# EAGLE design board (EAGLE 6.4)

## Sheet 1 of 5
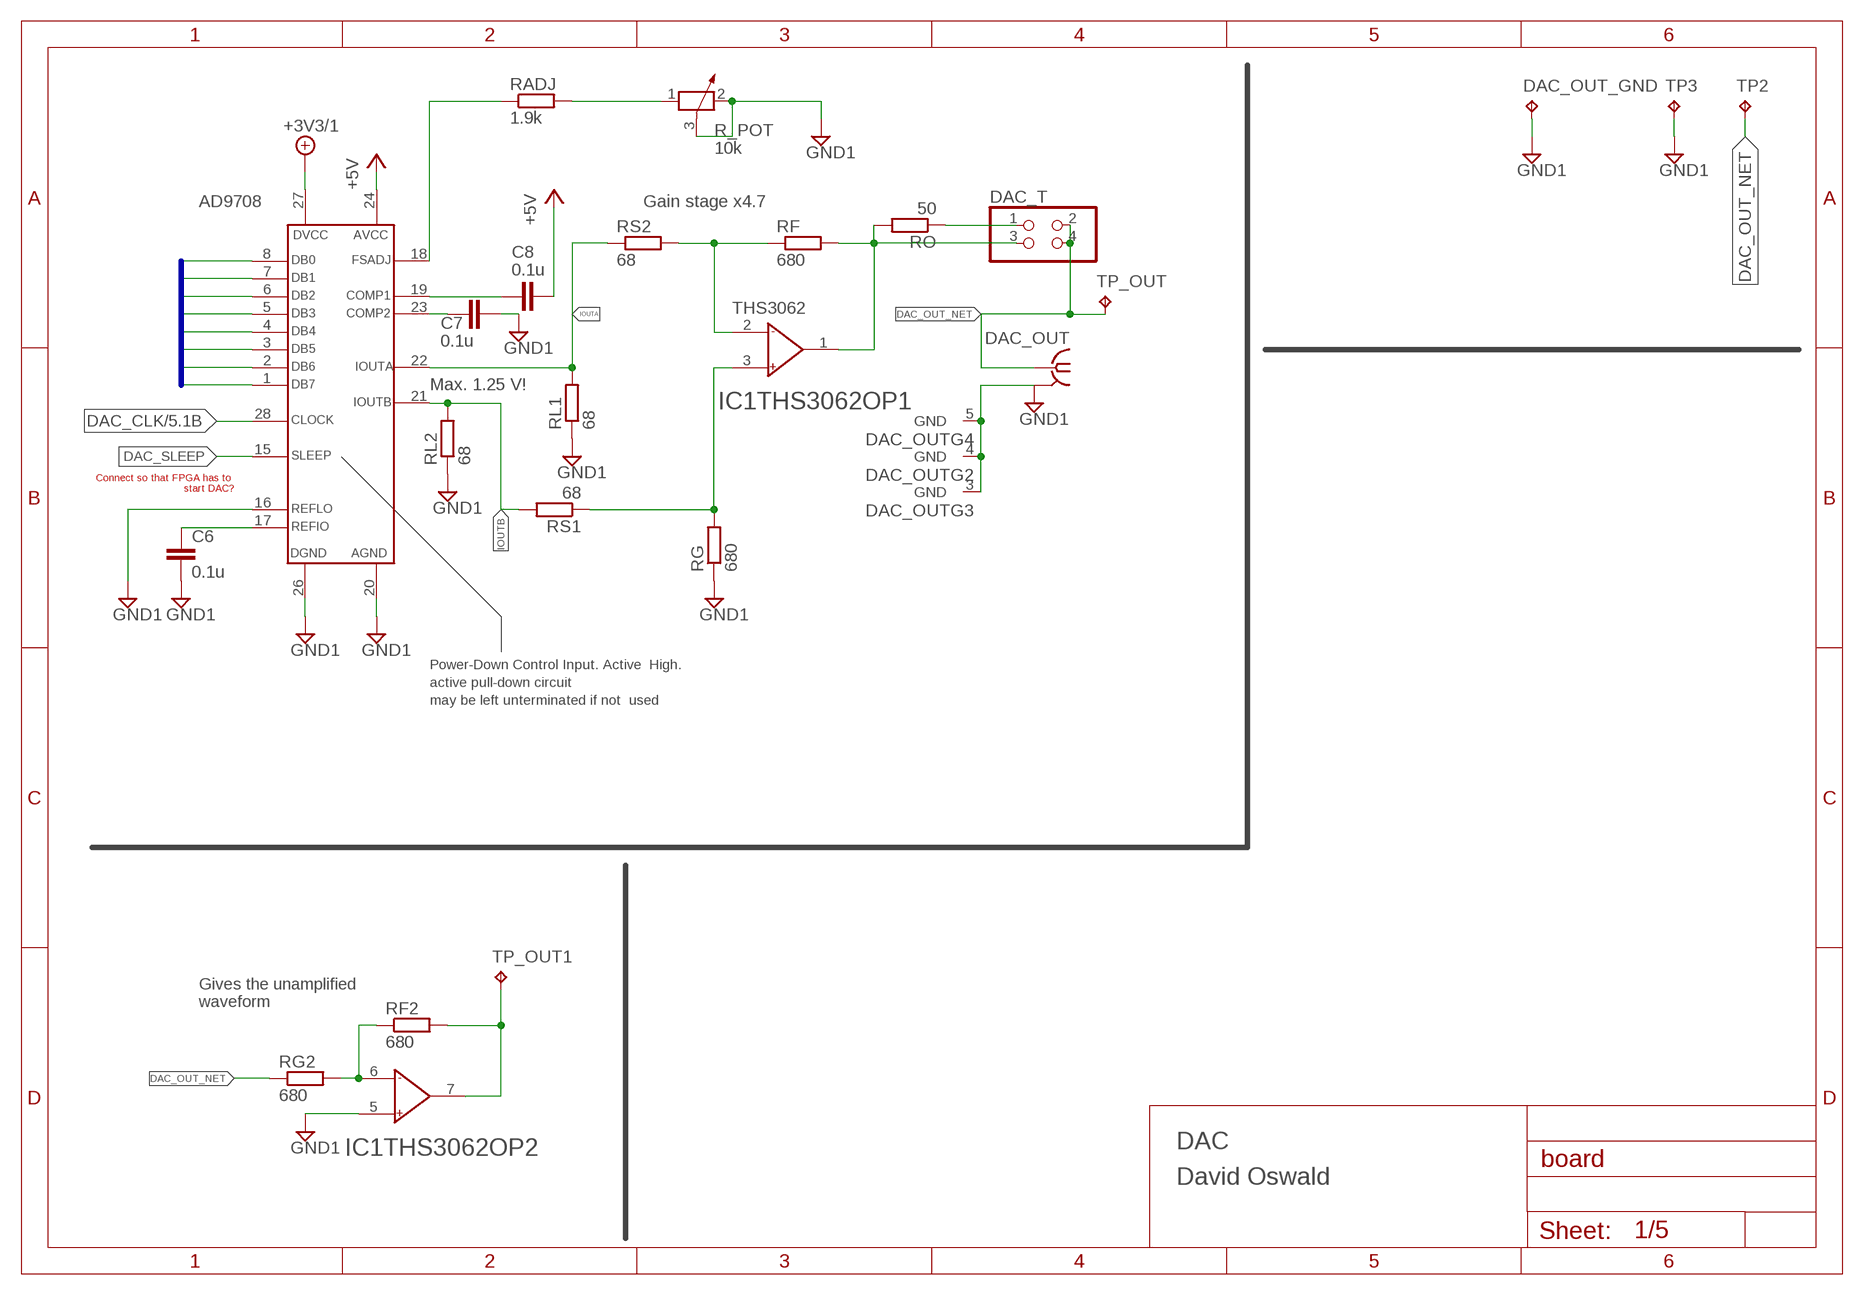
[diagram p0: schematic, sheet 1]

### Parts
AD9708  AD7908  [SO28W]
C6  0.1u  C-EUC0805K  [C0805K]
C7  0.1u  C-EUC0805K  [C0805K]
C8  0.1u  C-EUC0805K  [C0805K]
DAC_OUT  BU-SMA-V  [BU-SMA-V]
DAC_OUT_GND  TPB1,27  [B1,27]
DAC_T  PINHD-2X2  [2X02]
IC1  THS3062  [SO08]
R_POT  10k  POTENTIOMETER_PT_SPIN  [PT-SPIN]
RADJ  1.9k  R-EU_R0805  [R0805]
RF  680  R-EU_R0805  [R0805]
RF2  680  R-EU_R0805  [R0805]
RG  680  R-EU_R0805  [R0805]
RG2  680  R-EU_R0805  [R0805]
RL1  68  R-EU_R0805  [R0805]
RL2  68  R-EU_R0805  [R0805]
RO  50  R-EU_R0805  [R0805]
RS1  68  R-EU_R0805  [R0805]
RS2  68  R-EU_R0805  [R0805]
TP2  TPPAD1-13  [P1-13]
TP3  TPPAD1-13  [P1-13]
TP_OUT  TPB1,27  [B1,27]
TP_OUT1  TPB1,27  [B1,27]

### Nets
+5V: AD9708.24(AVCC) C8.1 ; also sheet 3,4
+5V/1: AD9708.27(DVCC) ; supply symbol labelled +3V3/1 ; also sheet 3,4,5
COMP1: AD9708.19(COMP1) C8.2
COMP2: AD9708.23(COMP2) C7.1
DAC_CLK: AD9708.28(CLOCK) ; also sheet 5
DAC_OUT_NET: DAC_OUT.1 DAC_T.2 DAC_T.4 RG2.1 TP2.TP TP_OUT.TP
DAC_SLEEP: AD9708.15(SLEEP)
DB0: AD9708.8(DB0) ; also sheet 5
DB1: AD9708.7(DB1) ; also sheet 5
DB2: AD9708.6(DB2) ; also sheet 5
DB3: AD9708.5(DB3) ; also sheet 5
DB4: AD9708.4(DB4) ; also sheet 5
DB5: AD9708.3(DB5) ; also sheet 5
DB6: AD9708.2(DB6) ; also sheet 5
DB7: AD9708.1(DB7) ; also sheet 5
FSADJ: AD9708.18(FSADJ) RADJ.1
GND1: AD9708.16(REFLO) AD9708.20(AGND) AD9708.26(DGND) C6.2 C7.2 DAC_OUT.2(GND) DAC_OUT.3(GND) DAC_OUT.4(GND) DAC_OUT.5(GND) DAC_OUT_GND.TP IC1.5(THS3062OP2:IN+) R_POT.2 R_POT.3 RG.1 RL1.1 RL2.1 TP3.TP ; also sheet 3
IOUTA: AD9708.22(IOUTA) RL1.2 RS2.1
IOUTB: AD9708.21(IOUTB) RL2.2 RS1.2
N$10: IC1.3(THS3062OP1:IN+) RG.2 RS1.1
N$11: IC1.2(THS3062OP1:IN-) RF.1 RS2.2
N$12: DAC_T.3 IC1.1(THS3062OP1:OUT) RF.2 RO.2
N$18: DAC_T.1 RO.1
N$19: R_POT.1 RADJ.2
N$24: IC1.6(THS3062OP2:IN-) RF2.1 RG2.2
N$33: IC1.7(THS3062OP2:OUT) RF2.2 TP_OUT1.TP
REFIO: AD9708.17(REFIO) C6.1

### Buses
DB0,DB1,DB2,DB3,DB4,DB5,DB6,DB7

### Notes on the sheet
- Gain stage x4.7
- THS3062
- Max. 1.25 V!
- Connect so that FPGA has to 
  start DAC?
- Power-Down Control Input. Active  High.
- active pull-down circuit
- may be left unterminated if not  used
- Gives the unamplified 
  waveform
- DAC
- David Oswald

## Sheet 2 of 5
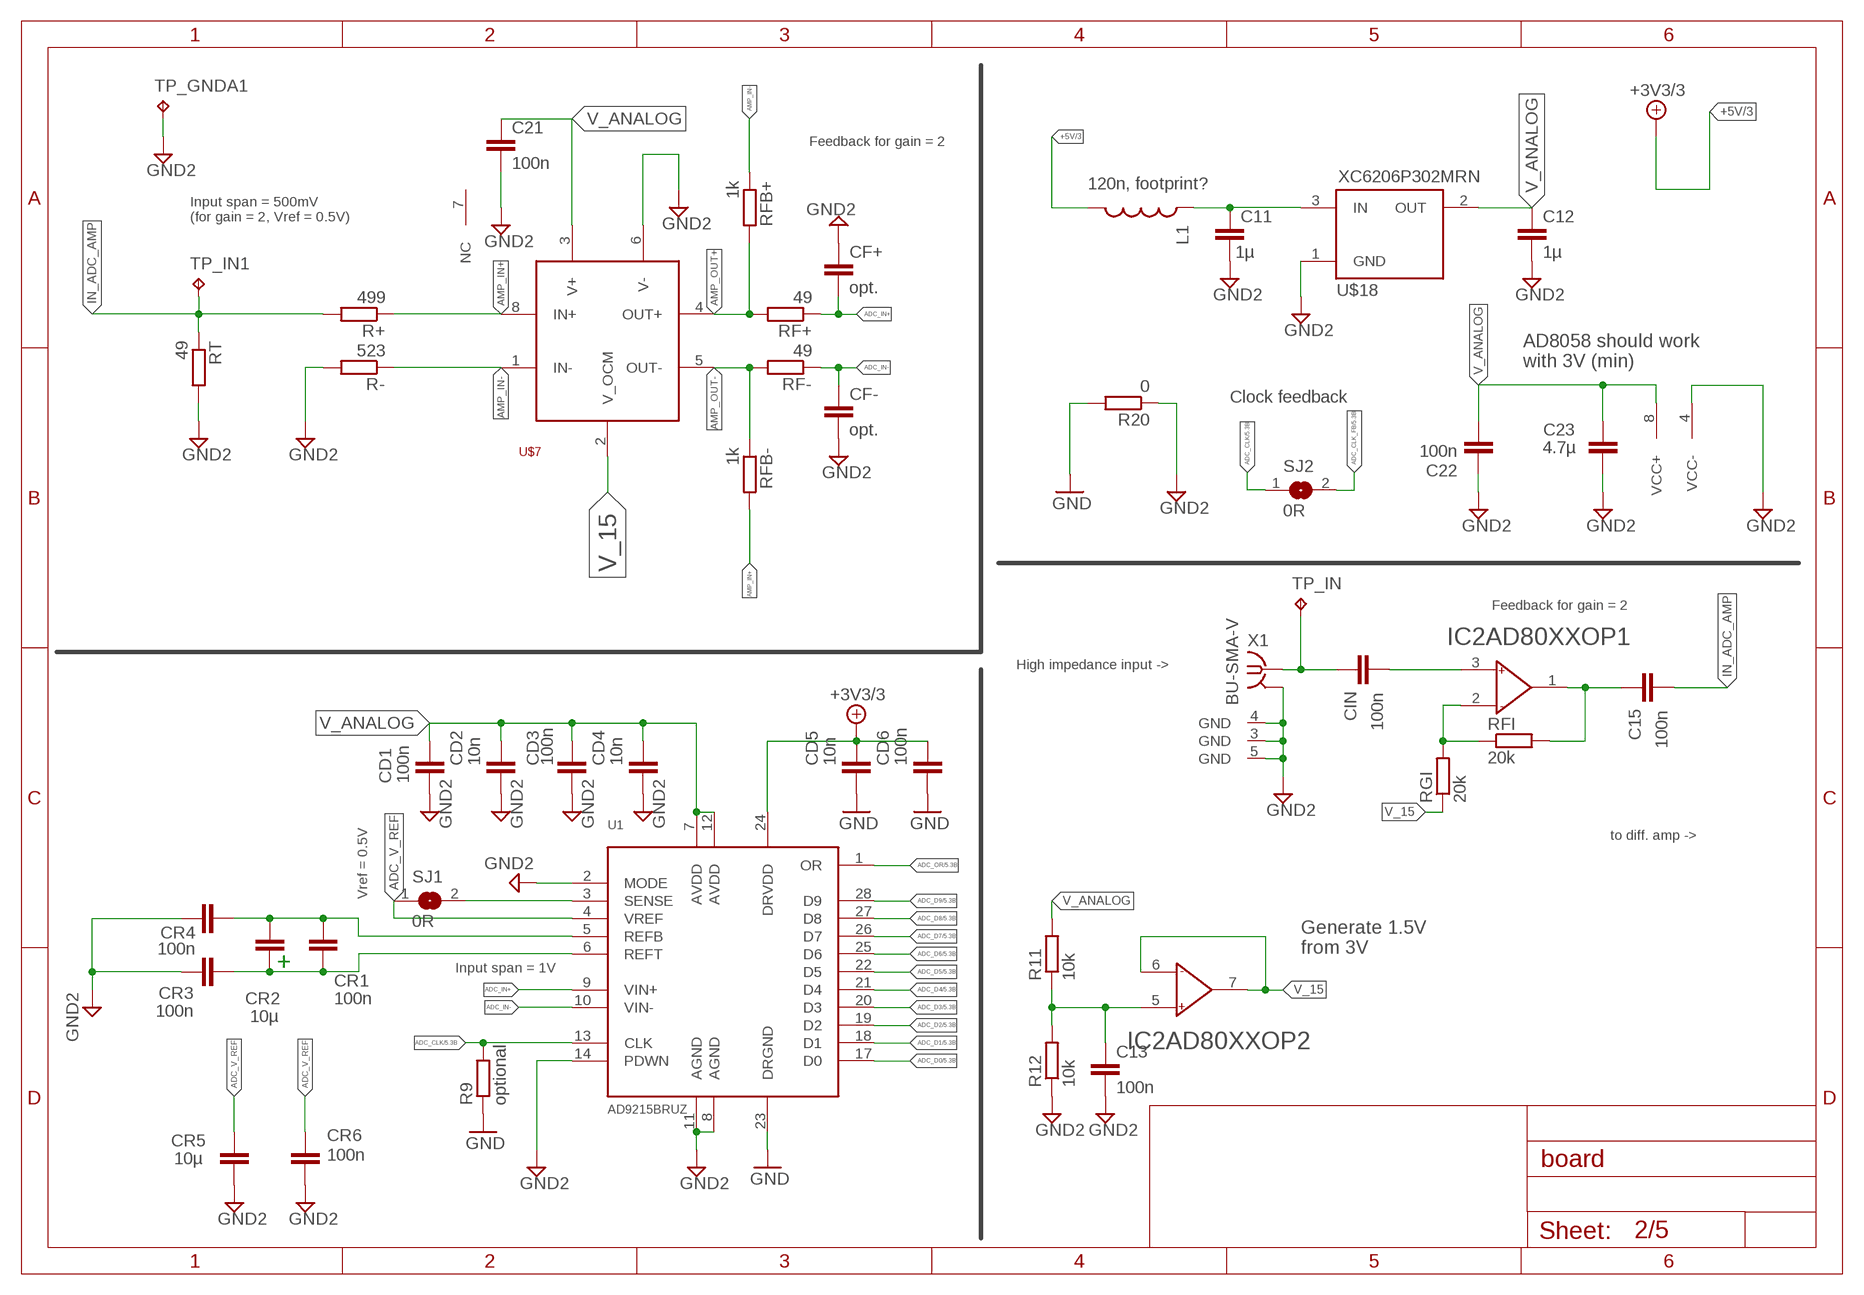
[diagram p1: schematic, sheet 2]

### Parts
C11  1µ  C-EUC0805K  [C0805K]
C12  1µ  C-EUC0805K  [C0805K]
C13  100n  C-EUC0805  [C0805]
C15  100n  C-EUC0603  [C0603]
C21  100n  C-EUC0603  [C0603]
C22  100n  C-EUC0603  [C0603]
C23  4.7µ  C-EUC0805K  [C0805K]
CD1  100n  C-EUC0603  [C0603]
CD2  10n  C-EUC0603  [C0603]
CD3  100n  C-EUC0603  [C0603]
CD4  10n  C-EUC0603  [C0603]
CD5  10n  C-EUC0603  [C0603]
CD6  100n  C-EUC0603  [C0603]
CF+  opt.  C-EUC0603  [C0603]
CF-  opt.  C-EUC0603  [C0603]
CIN  100n  C-EUC0603  [C0603]
CR1  100n  C-EUC0603  [C0603]
CR2  10µ  C-EUC0805K  [C0805K]
CR3  100n  C-EUC0603  [C0603]
CR4  100n  C-EUC0603  [C0603]
CR5  10µ  C-EUC0805K  [C0805K]
CR6  100n  C-EUC0603  [C0603]
IC2  AD80XX  [SO08]
L1  120n, footprint?  INDUCTOR0805  [0805]
R9  optional  R-EU_R0805  [R0805]
R11  10k  R-EU_R0805  [R0805]
R12  10k  R-EU_R0805  [R0805]
R20  0  R-EU_R0805  [R0805]
R+  499  R-EU_R0603  [R0603]
R-  523  R-EU_R0603  [R0603]
RF+  49  R-EU_R0603  [R0603]
RF-  49  R-EU_R0603  [R0603]
RFB+  1k  R-EU_R0603  [R0603]
RFB-  1k  R-EU_R0603  [R0603]
RFI  20k  R-EU_R0603  [R0603]
RGI  20k  R-EU_R0603  [R0603]
RT  49  R-EU_R0603  [R0603]
SJ1  0R  SJ  [SJ]
SJ2  0R  SJ  [SJ]
TP_GNDA1  TPPAD1-13  [P1-13]
TP_IN  TPPAD1-13  [P1-13]
TP_IN1  TPPAD1-13  [P1-13]
U1  AD9215BRUZ  [TSSOP28]
U$7  AD8138  [SOIC8]
U$18  XC6206P302MRN  XC6206  [SOT23]
X1  BU-SMA-V  [BU-SMA-V]

### Nets
+5V/3: CD5.1 CD6.1 L1.2 U1.24(DRVDD) ; supply symbol labelled +3V3/3 ; also sheet 4,5
ADC_CLK: R9.2 SJ2.1 U1.13(CLK) ; also sheet 5
ADC_CLK_FB: SJ2.2 ; also sheet 5
ADC_D0: U1.17(D0) ; also sheet 5
ADC_D1: U1.18(D1) ; also sheet 5
ADC_D2: U1.19(D2) ; also sheet 5
ADC_D3: U1.20(D3) ; also sheet 5
ADC_D4: U1.21(D4) ; also sheet 5
ADC_D5: U1.22(D5) ; also sheet 5
ADC_D6: U1.25(D6) ; also sheet 5
ADC_D7: U1.26(D7) ; also sheet 5
ADC_D8: U1.27(D8) ; also sheet 5
ADC_D9: U1.28(D9) ; also sheet 5
ADC_IN+: CF+.2 RF+.1 U1.9(VIN+)
ADC_IN-: CF-.1 RF-.1 U1.10(VIN-)
ADC_OR: U1.1(OR) ; also sheet 5
ADC_V_REF: CR5.2 CR6.2 SJ1.1 U1.4(VREF)
AMP_IN+: R+.1 RFB-.2 U$7.8(IN+)
AMP_IN-: R-.1 RFB+.1 U$7.1(IN-)
AMP_OUT+: RF+.2 RFB+.2 U$7.4(OUT+)
AMP_OUT-: RF-.2 RFB-.1 U$7.5(OUT-)
GND: CD5.2 CD6.2 R9.1 R20.2 U1.23(DRGND) ; also sheet 3,4,5
GND2: C11.2 C12.2 C13.2 C21.2 C22.2 C23.1 CD1.2 CD2.2 CD3.2 CD4.2 CF+.1 CF-.2 CR3.1 CR4.1 CR5.1 CR6.1 R12.1 R20.1 R-.2 RT.2 TP_GNDA1.TP U1.2(MODE) U1.8(AGND) U1.11(AGND) U1.14(PDWN) U$7.6(V-) U$18.1(GND) X1.2(GND) X1.3(GND) X1.4(GND) X1.5(GND)
IN_ADC_AMP: C15.2 R+.2 RT.1 TP_IN1.TP
N$3: C11.1 L1.1 U$18.3(IN)
N$4: SJ1.2 U1.3(SENSE)
N$5: CR1.2 CR2.2 CR3.2 U1.6(REFT)
N$6: CR1.1 CR2.1 CR4.2 U1.5(REFB)
N$8: CIN.1 TP_IN.TP X1.1
N$9: CIN.2 IC2.3(AD80XXOP1:IN+)
N$21: C15.1 IC2.1(AD80XXOP1:OUT) RFI.2
N$25: IC2.2(AD80XXOP1:IN-) RFI.1 RGI.2
OP-: IC2.4(SUPPLY:VCC-) ; supply symbol labelled GND2
V_15: IC2.6(AD80XXOP2:IN-) IC2.7(AD80XXOP2:OUT) RGI.1 U$7.2(V_OCM)
V_15_UNBUF: C13.1 IC2.5(AD80XXOP2:IN+) R11.1 R12.2
V_ANALOG: C12.1 C21.1 C22.1 C23.2 CD1.1 CD2.1 CD3.1 CD4.1 IC2.8(SUPPLY:VCC+) R11.2 U1.7(AVDD) U1.12(AVDD) U$7.3(V+) U$18.2(OUT)
Unconnected: U$7.7(NC)

### Notes on the sheet
- Feedback for gain = 2
- Input span = 500mV
  (for gain = 2, Vref = 0.5V)
- AD8058 should work
  with 3V (min)
- Clock feedback
- Feedback for gain = 2
- High impedance input ->
- to diff. amp ->
- Vref = 0.5V
- Generate 1.5V
  from 3V
- Input span = 1V
- +

## Sheet 3 of 5
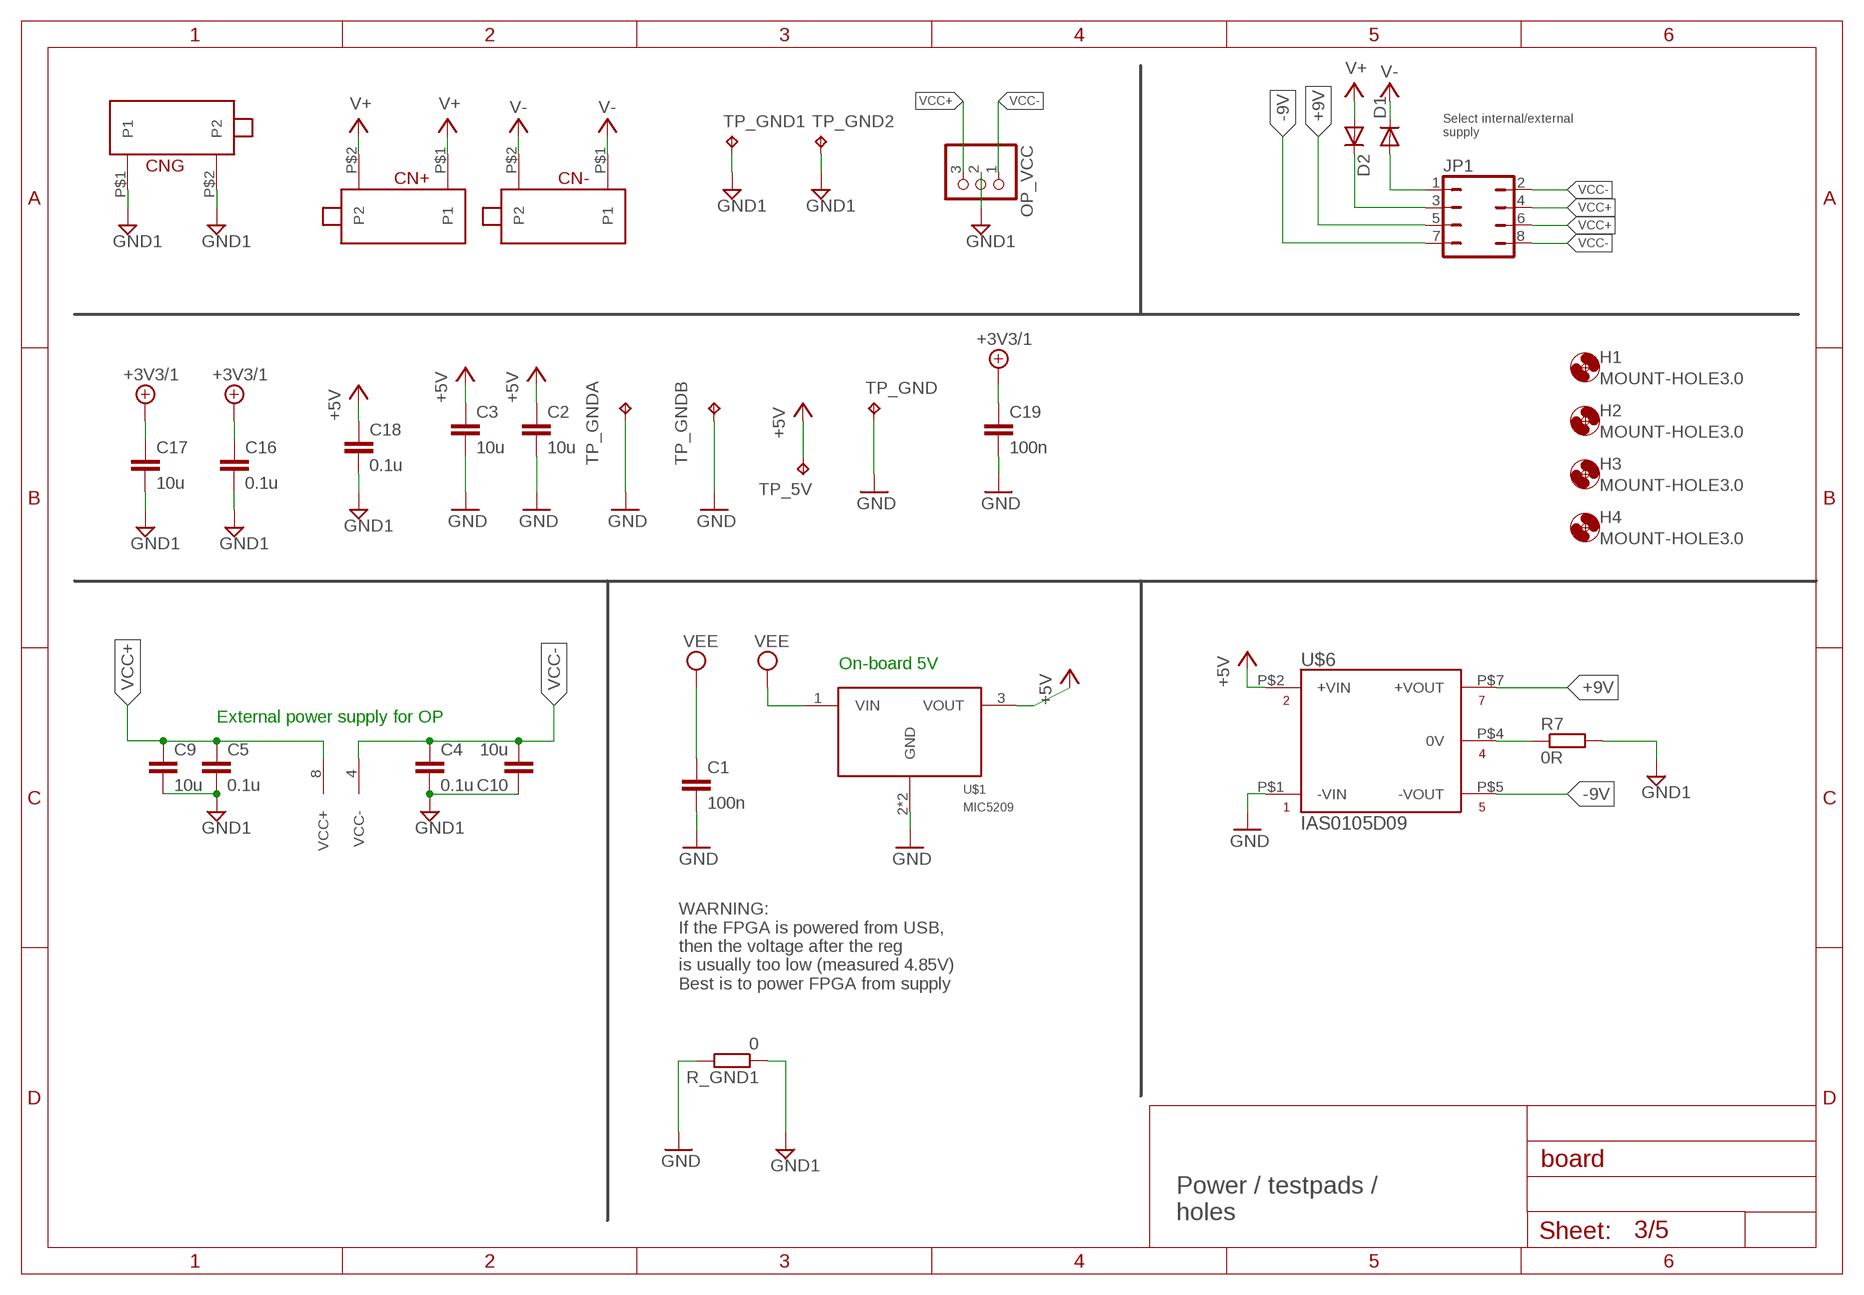
[diagram p2: schematic, sheet 3]

### Parts
C1  100n  C-EUC0805K  [C0805K]
C2  10u  C-EUC0805K  [C0805K]
C3  10u  C-EUC0805K  [C0805K]
C4  0.1u  C-EUC0805K  [C0805K]
C5  0.1u  C-EUC0805K  [C0805K]
C9  10u  C-EUC0805K  [C0805K]
C10  10u  C-EUC0805K  [C0805K]
C16  0.1u  C-EUC0805K  [C0805K]
C17  10u  C-EUC0805K  [C0805K]
C18  0.1u  C-EUC0805K  [C0805K]
C19  100n  C-EUC0805K  [C0805K]
CN+  24243  [24_243]
CN-  24243  [24_243]
CNG  24243  [24_243]
D1  DIODE-SOD123  [SOD123]
D2  DIODE-SOD123  [SOD123]
H1  MOUNT-HOLE3.0  [3,0]
H2  MOUNT-HOLE3.0  [3,0]
H3  MOUNT-HOLE3.0  [3,0]
H4  MOUNT-HOLE3.0  [3,0]
JP1  JP4Q  [JP4Q]
OP_VCC  PINHD-1X3  [1X03]
R7  0R  R-EU_M0805  [M0805]
R_GND1  0  R-EU_R0805  [R0805]
TP_5V  TPB1,27  [B1,27]
TP_GND  TPB1,27  [B1,27]
TP_GND1  TPB1,27  [B1,27]
TP_GND2  TPPAD1-13  [P1-13]
TP_GNDA  TPPAD1-13  [P1-13]
TP_GNDB  TPPAD1-13  [P1-13]
U$1  MIC5209  [SOT223-3]
U$6  IAS0105D09  [SMD-DIP10]

### Nets
+5V: C2.1 C3.1 C18.1 TP_5V.TP U$1.3(VOUT) U$6.P$2(+VIN) ; also sheet 1,4
+5V/1: C16.1 C17.1 C19.1 ; supply symbol labelled +3V3/1 ; also sheet 1,4,5
+9V: JP1.5 U$6.P$7(+VOUT)
-9V: JP1.7 U$6.P$5(-VOUT)
GND: C1.2 C2.2 C3.2 C19.2 R_GND1.2 TP_GND.TP TP_GNDA.TP TP_GNDB.TP U$1.2(GND) U$1.4(GND) U$6.P$1(-VIN) ; also sheet 2,4,5
GND1: C4.2 C5.2 C9.2 C10.1 C16.2 C17.2 C18.2 CNG.P$1(P1) CNG.P$2(P2) OP_VCC.2 R7.2 R_GND1.1 TP_GND1.TP TP_GND2.TP ; also sheet 1
N$7: R7.1 U$6.P$4(0V)
N$13: D2.C JP1.3
N$17: D1.A JP1.1
V+: CN+.P$1(P1) CN+.P$2(P2) D2.A
V-: CN-.P$1(P1) CN-.P$2(P2) D1.C
VCC+: C5.1 C9.1 IC1.8(SUPPLY:VCC+) JP1.4 JP1.6 OP_VCC.3
VCC-: C4.1 C10.2 IC1.4(SUPPLY:VCC-) JP1.2 JP1.8 OP_VCC.1
VEE: C1.1 U$1.1(VIN) ; also sheet 5

### Notes on the sheet
- Select internal/external
  supply
- On-board 5V
- External power supply for OP
- WARNING:
  If the FPGA is powered from USB,
  then the voltage after the reg
  is usually too low (measured 4.85V)
  Best is to power FPGA from supply
- Power / testpads / 
  holes

## Sheet 4 of 5
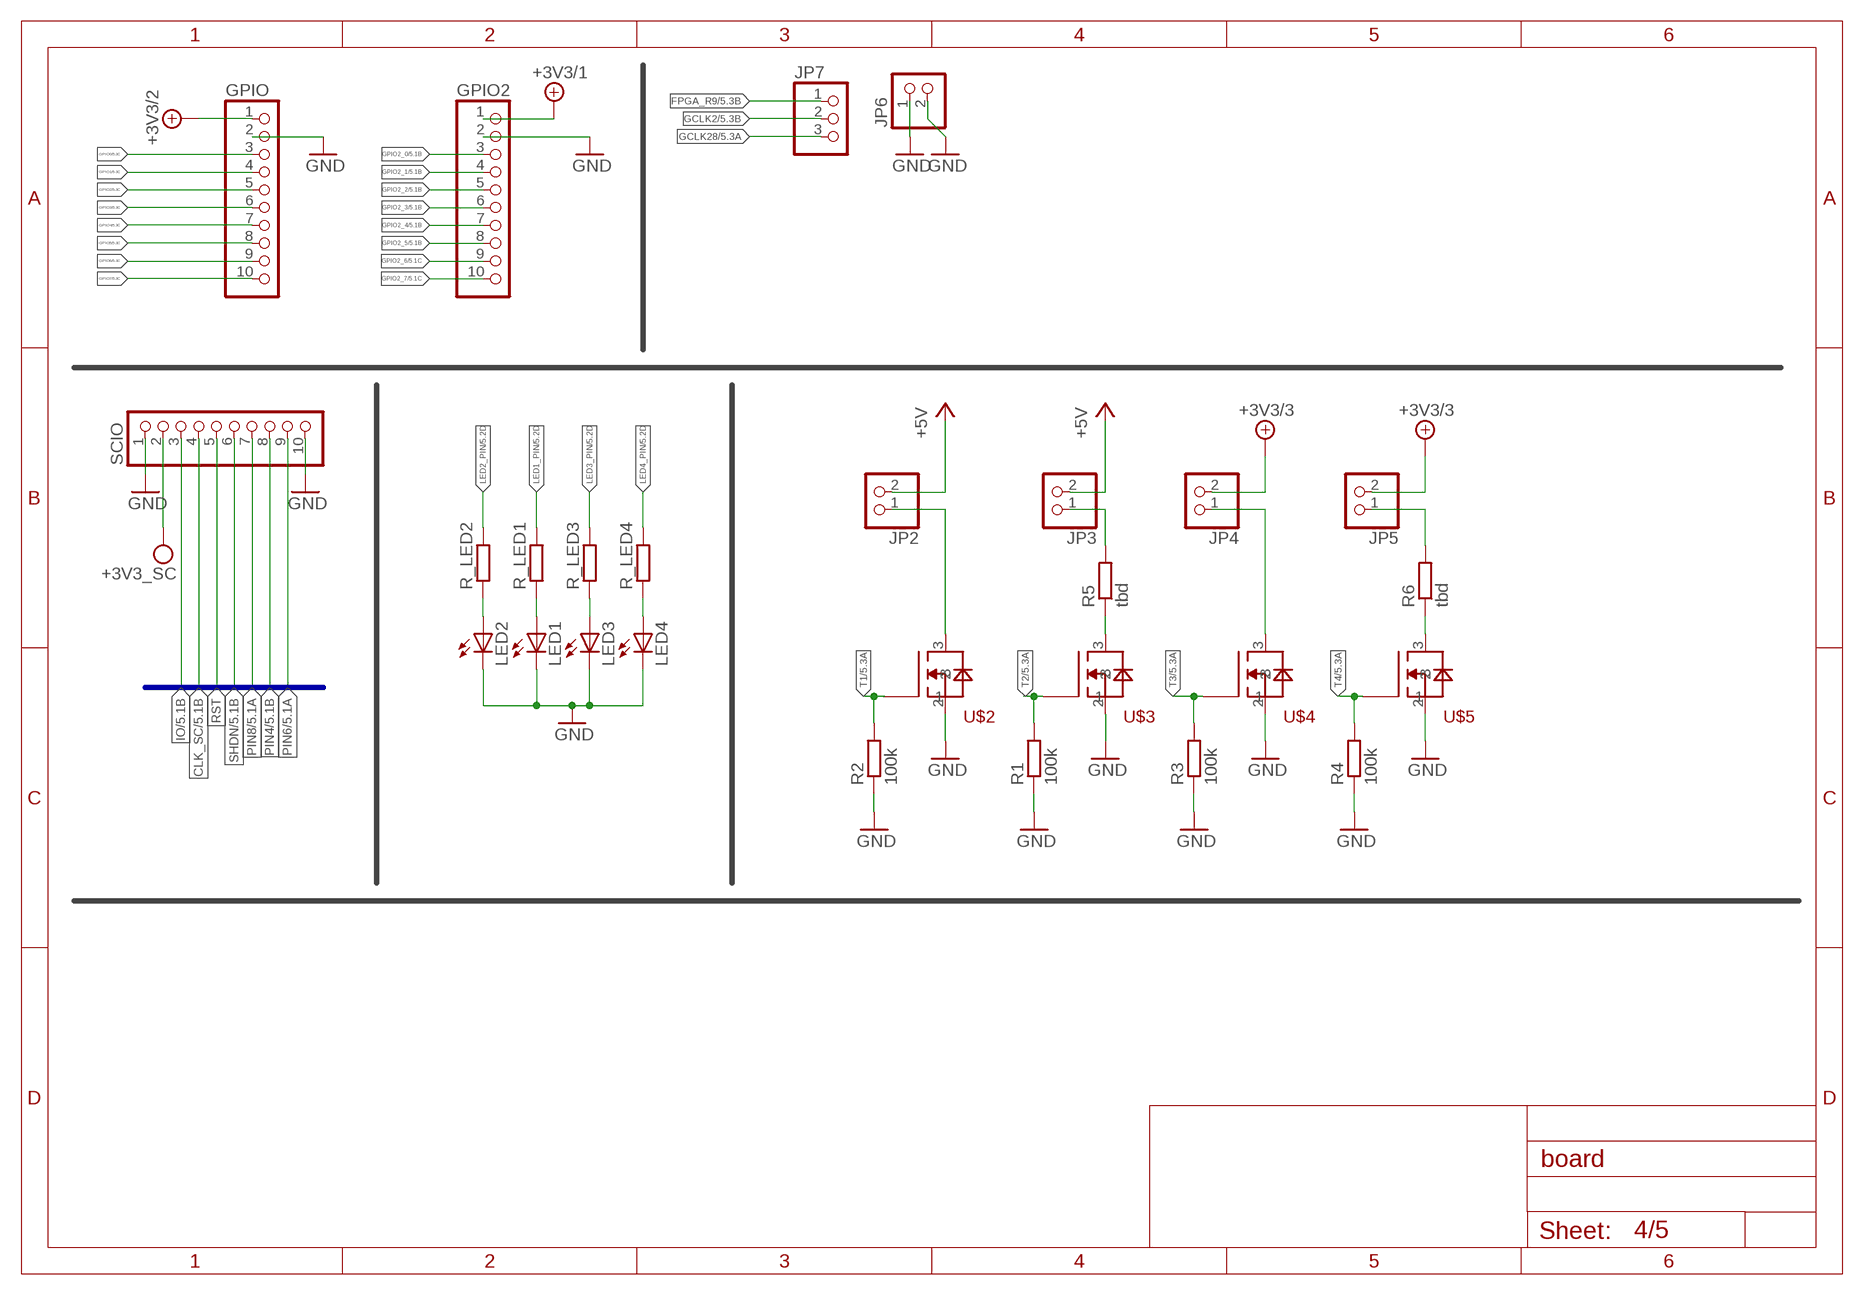
[diagram p3: schematic, sheet 4]

### Parts
GPIO  PINHD-1X10  [1X10]
GPIO2  PINHD-1X10  [1X10]
JP2  PINHD-1X2  [1X02]
JP3  PINHD-1X2  [1X02]
JP4  PINHD-1X2  [1X02]
JP5  PINHD-1X2  [1X02]
JP6  PINHD-1X2  [1X02]
JP7  PINHD-1X3  [1X03]
LED1  LEDCHIPLED_0805  [CHIPLED_0805]
LED2  LEDCHIPLED_0805  [CHIPLED_0805]
LED3  LEDCHIPLED_0805  [CHIPLED_0805]
LED4  LEDCHIPLED_0805  [CHIPLED_0805]
R1  100k  R-EU_M0805  [M0805]
R2  100k  R-EU_M0805  [M0805]
R3  100k  R-EU_M0805  [M0805]
R4  100k  R-EU_M0805  [M0805]
R5  tbd  R-EU_M0805  [M0805]
R6  tbd  R-EU_M0805  [M0805]
R_LED1  R-EU_R0805  [R0805]
R_LED2  R-EU_R0805  [R0805]
R_LED3  R-EU_R0805  [R0805]
R_LED4  R-EU_R0805  [R0805]
SCIO  PINHD-1X10  [1X10]
U$2  DMG1012UW  [DMG1012UW1-SMT323]
U$3  DMG1012UW  [DMG1012UW1-SMT323]
U$4  DMG1012UW  [DMG1012UW1-SMT323]
U$5  DMG1012UW  [DMG1012UW1-SMT323]

### Nets
+5V: JP2.2 JP3.2 ; also sheet 1,3
+5V/1: GPIO2.1 ; supply symbol labelled +3V3/1 ; also sheet 1,3,5
+5V/2: GPIO.1 ; supply symbol labelled +3V3/2 ; also sheet 5
+5V/3: JP4.2 JP5.2 ; supply symbol labelled +3V3/3 ; also sheet 2,5
CLK_SC: SCIO.4 ; also sheet 5
FPGA_R9: JP7.1 ; also sheet 5
GCLK2: JP7.2 ; also sheet 5
GCLK28: JP7.3 ; also sheet 5
GND: GPIO2.2 GPIO.2 JP6.1 JP6.2 LED1.C LED2.C LED3.C LED4.C R1.1 R2.1 R3.1 R4.1 SCIO.1 SCIO.10 U$2.2 U$3.2 U$4.2 U$5.2 ; also sheet 2,3,5
GPIO0: GPIO.3 ; also sheet 5
GPIO1: GPIO.4 ; also sheet 5
GPIO2: GPIO.5 ; also sheet 5
GPIO2_0: GPIO2.3 ; also sheet 5
GPIO2_1: GPIO2.4 ; also sheet 5
GPIO2_2: GPIO2.5 ; also sheet 5
GPIO2_3: GPIO2.6 ; also sheet 5
GPIO2_4: GPIO2.7 ; also sheet 5
GPIO2_5: GPIO2.8 ; also sheet 5
GPIO2_6: GPIO2.9 ; also sheet 5
GPIO2_7: GPIO2.10 ; also sheet 5
GPIO3: GPIO.6 ; also sheet 5
GPIO4: GPIO.7 ; also sheet 5
GPIO5: GPIO.8 ; also sheet 5
GPIO6: GPIO.9 ; also sheet 5
GPIO7: GPIO.10 ; also sheet 5
IO: SCIO.3 ; also sheet 5
LED1_PIN: R_LED1.2 ; also sheet 5
LED2_PIN: R_LED2.2 ; also sheet 5
LED3_PIN: R_LED3.2 ; also sheet 5
LED4_PIN: R_LED4.2 ; also sheet 5
N$14: R5.1 U$3.3
N$15: JP2.1 U$2.3
N$16: JP3.1 R5.2
N$20: R6.1 U$5.3
N$22: JP4.1 U$4.3
N$23: JP5.1 R6.2
N$34: LED2.A R_LED2.1
N$35: LED1.A R_LED1.1
N$50: LED3.A R_LED3.1
N$51: LED4.A R_LED4.1
PIN4: SCIO.8 ; also sheet 5
PIN6: SCIO.9 ; also sheet 5
PIN8: SCIO.7 ; also sheet 5
RST: SCIO.5 ; also sheet 5
SHDN: SCIO.6 ; also sheet 5
T1: R2.2 U$2.1 ; also sheet 5
T2: R1.2 U$3.1 ; also sheet 5
T3: R3.2 U$4.1 ; also sheet 5
T4: R4.2 U$5.1 ; also sheet 5
VPP: SCIO.2 ; supply symbol labelled +3V3_SC ; also sheet 5

### Buses
SW1,SW2,PIN8,PIN4,IO,CLK_SC,PIN6,RST,SHDN

## Sheet 5 of 5
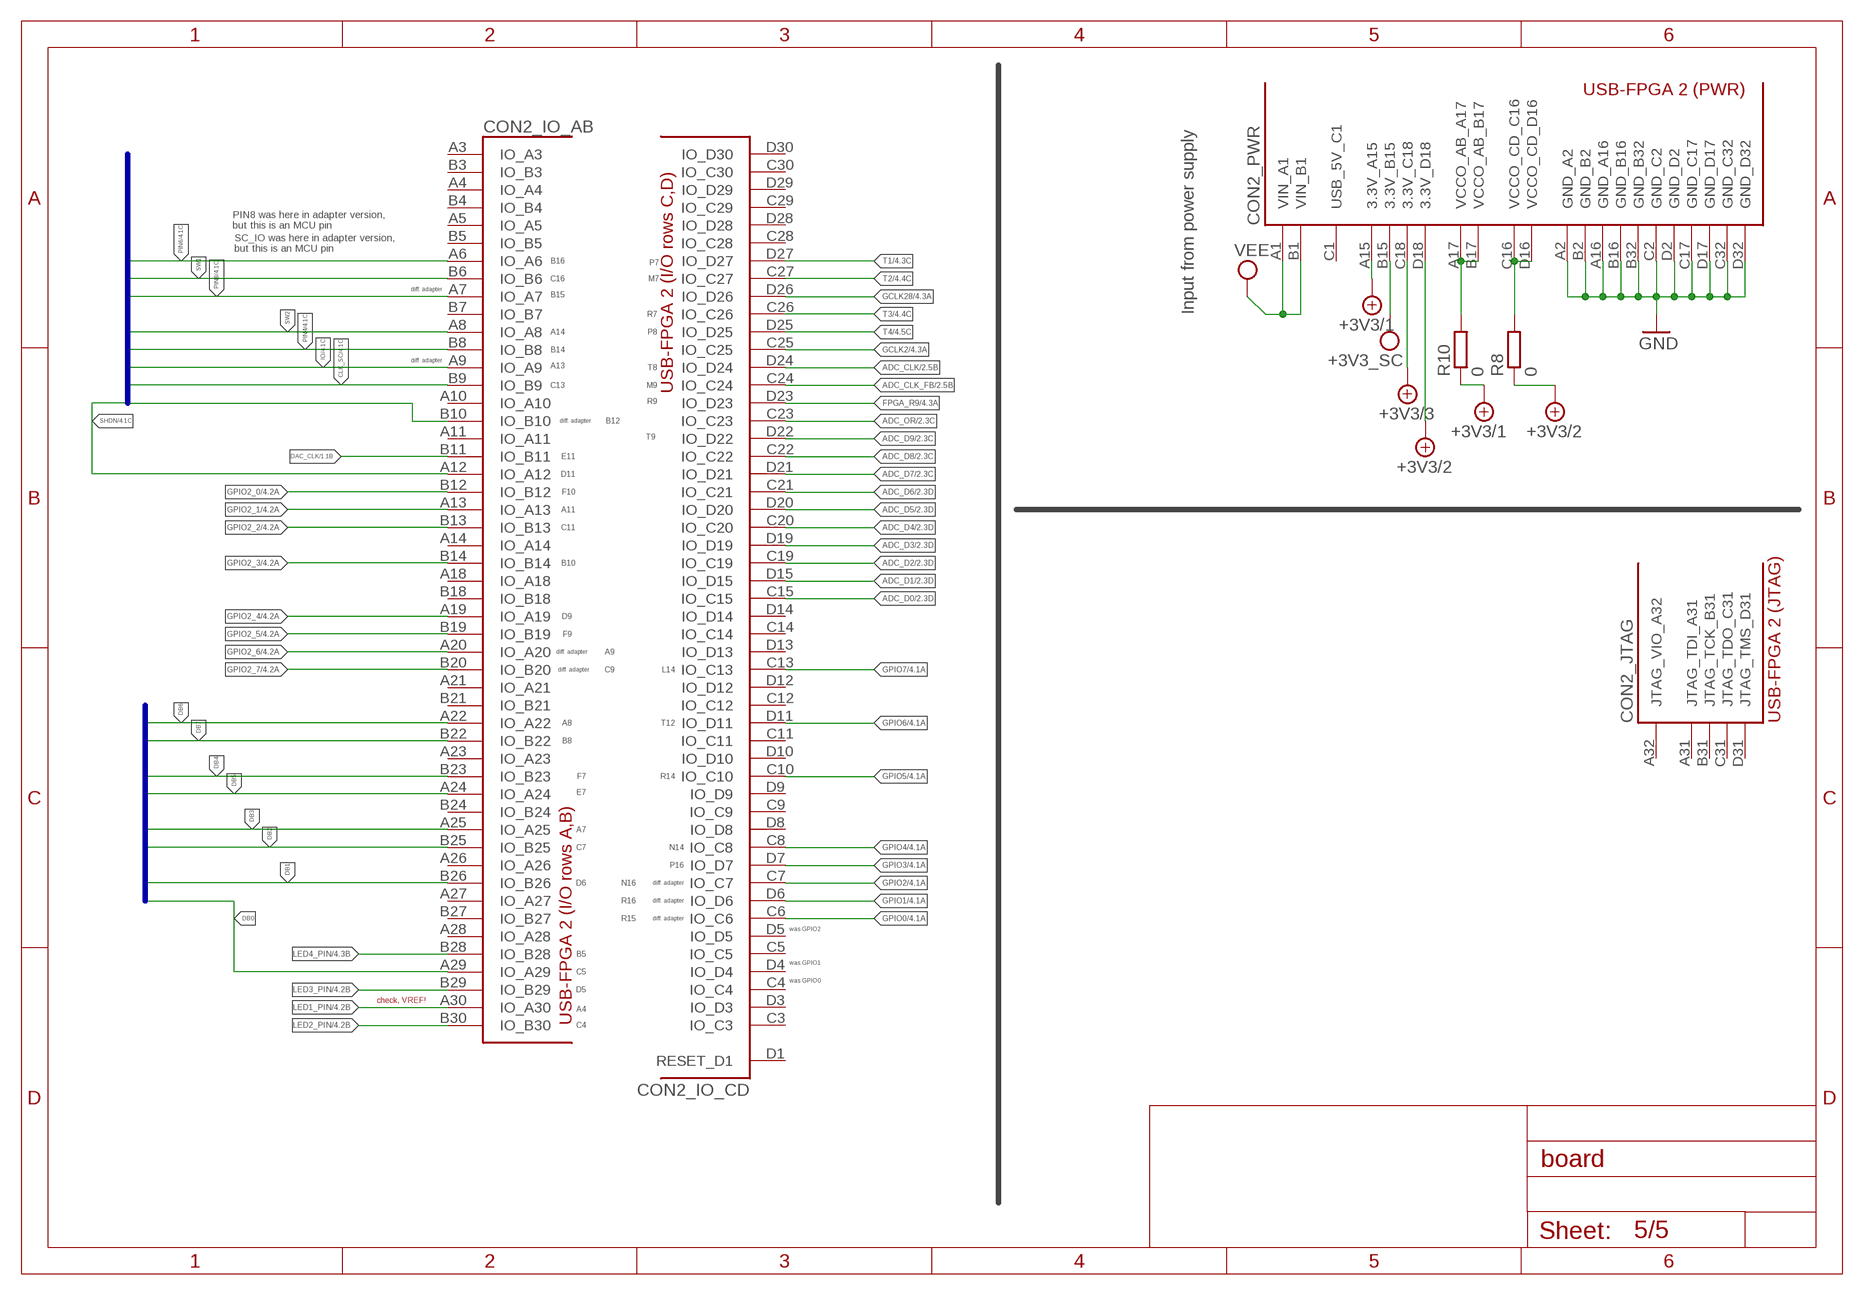
[diagram p4: schematic, sheet 5]

### Parts
CON2  USB-FPGA-2THT  [USB-FPGA-2-THT]
R8  0  R-EU_R0805  [R0805]
R10  0  R-EU_R0805  [R0805]

### Nets
+5V/1: CON2.A15(_PWR:3.3V_A15) R10.1 ; supply symbol labelled +3V3/1 ; also sheet 1,3,4
+5V/2: CON2.D18(_PWR:3.3V_D18) R8.1 ; supply symbol labelled +3V3/2 ; also sheet 4
+5V/3: CON2.C18(_PWR:3.3V_C18) ; supply symbol labelled +3V3/3 ; also sheet 2,4
ADC_CLK: CON2.D24(_IO_CD:IO_D24) ; also sheet 2
ADC_CLK_FB: CON2.C24(_IO_CD:IO_C24) ; also sheet 2
ADC_D0: CON2.C15(_IO_CD:IO_C15) ; also sheet 2
ADC_D1: CON2.D15(_IO_CD:IO_D15) ; also sheet 2
ADC_D2: CON2.C19(_IO_CD:IO_C19) ; also sheet 2
ADC_D3: CON2.D19(_IO_CD:IO_D19) ; also sheet 2
ADC_D4: CON2.C20(_IO_CD:IO_C20) ; also sheet 2
ADC_D5: CON2.D20(_IO_CD:IO_D20) ; also sheet 2
ADC_D6: CON2.C21(_IO_CD:IO_C21) ; also sheet 2
ADC_D7: CON2.D21(_IO_CD:IO_D21) ; also sheet 2
ADC_D8: CON2.C22(_IO_CD:IO_C22) ; also sheet 2
ADC_D9: CON2.D22(_IO_CD:IO_D22) ; also sheet 2
ADC_OR: CON2.C23(_IO_CD:IO_C23) ; also sheet 2
CLK_SC: CON2.B9(_IO_AB:IO_B9) ; also sheet 4
DAC_CLK: CON2.B11(_IO_AB:IO_B11) ; also sheet 1
DB0: CON2.A29(_IO_AB:IO_A29) ; also sheet 1
DB1: CON2.B26(_IO_AB:IO_B26) ; also sheet 1
DB2: CON2.B25(_IO_AB:IO_B25) ; also sheet 1
DB3: CON2.A25(_IO_AB:IO_A25) ; also sheet 1
DB4: CON2.B23(_IO_AB:IO_B23) ; also sheet 1
DB5: CON2.A24(_IO_AB:IO_A24) ; also sheet 1
DB6: CON2.A22(_IO_AB:IO_A22) ; also sheet 1
DB7: CON2.B22(_IO_AB:IO_B22) ; also sheet 1
FPGA_R9: CON2.D23(_IO_CD:IO_D23) ; also sheet 4
GCLK2: CON2.C25(_IO_CD:IO_C25) ; also sheet 4
GCLK28: CON2.D26(_IO_CD:IO_D26) ; also sheet 4
GND: CON2.A2(_PWR:GND_A2) CON2.A16(_PWR:GND_A16) CON2.B2(_PWR:GND_B2) CON2.B16(_PWR:GND_B16) CON2.B32(_PWR:GND_B32) CON2.C2(_PWR:GND_C2) CON2.C17(_PWR:GND_C17) CON2.C32(_PWR:GND_C32) CON2.D2(_PWR:GND_D2) CON2.D17(_PWR:GND_D17) CON2.D32(_PWR:GND_D32) ; also sheet 2,3,4
GPIO0: CON2.C6(_IO_CD:IO_C6) ; also sheet 4
GPIO1: CON2.D6(_IO_CD:IO_D6) ; also sheet 4
GPIO2: CON2.C7(_IO_CD:IO_C7) ; also sheet 4
GPIO2_0: CON2.B12(_IO_AB:IO_B12) ; also sheet 4
GPIO2_1: CON2.A13(_IO_AB:IO_A13) ; also sheet 4
GPIO2_2: CON2.B13(_IO_AB:IO_B13) ; also sheet 4
GPIO2_3: CON2.B14(_IO_AB:IO_B14) ; also sheet 4
GPIO2_4: CON2.A19(_IO_AB:IO_A19) ; also sheet 4
GPIO2_5: CON2.B19(_IO_AB:IO_B19) ; also sheet 4
GPIO2_6: CON2.A20(_IO_AB:IO_A20) ; also sheet 4
GPIO2_7: CON2.B20(_IO_AB:IO_B20) ; also sheet 4
GPIO3: CON2.D7(_IO_CD:IO_D7) ; also sheet 4
GPIO4: CON2.C8(_IO_CD:IO_C8) ; also sheet 4
GPIO5: CON2.C10(_IO_CD:IO_C10) ; also sheet 4
GPIO6: CON2.D11(_IO_CD:IO_D11) ; also sheet 4
GPIO7: CON2.C13(_IO_CD:IO_C13) ; also sheet 4
IO: CON2.A9(_IO_AB:IO_A9) ; also sheet 4
LED1_PIN: CON2.A30(_IO_AB:IO_A30) ; also sheet 4
LED2_PIN: CON2.B30(_IO_AB:IO_B30) ; also sheet 4
LED3_PIN: CON2.B29(_IO_AB:IO_B29) ; also sheet 4
LED4_PIN: CON2.B28(_IO_AB:IO_B28) ; also sheet 4
N$1: CON2.A17(_PWR:VCCO_AB_A17) CON2.B17(_PWR:VCCO_AB_B17) R10.2
N$2: CON2.C16(_PWR:VCCO_CD_C16) CON2.D16(_PWR:VCCO_CD_D16) R8.2
PIN4: CON2.B8(_IO_AB:IO_B8) ; also sheet 4
PIN6: CON2.A6(_IO_AB:IO_A6) ; also sheet 4
PIN8: CON2.A7(_IO_AB:IO_A7) ; also sheet 4
RST: CON2.B10(_IO_AB:IO_B10) ; also sheet 4
SHDN: CON2.A12(_IO_AB:IO_A12) ; also sheet 4
SW1: CON2.B6(_IO_AB:IO_B6)
SW2: CON2.A8(_IO_AB:IO_A8)
T1: CON2.D27(_IO_CD:IO_D27) ; also sheet 4
T2: CON2.C27(_IO_CD:IO_C27) ; also sheet 4
T3: CON2.C26(_IO_CD:IO_C26) ; also sheet 4
T4: CON2.D25(_IO_CD:IO_D25) ; also sheet 4
VEE: CON2.A1(_PWR:VIN_A1) CON2.B1(_PWR:VIN_B1) ; also sheet 3
VPP: CON2.B15(_PWR:3.3V_B15) ; supply symbol labelled +3V3_SC ; also sheet 4
Unconnected: CON2.A3(_IO_AB:IO_A3) CON2.A4(_IO_AB:IO_A4) CON2.A5(_IO_AB:IO_A5) CON2.A10(_IO_AB:IO_A10) CON2.A11(_IO_AB:IO_A11) CON2.A14(_IO_AB:IO_A14) CON2.A18(_IO_AB:IO_A18) CON2.A21(_IO_AB:IO_A21) CON2.A23(_IO_AB:IO_A23) CON2.A26(_IO_AB:IO_A26) CON2.A27(_IO_AB:IO_A27) CON2.A28(_IO_AB:IO_A28) CON2.A31(_JTAG:JTAG_TDI_A31) CON2.A32(_JTAG:JTAG_VIO_A32) CON2.B3(_IO_AB:IO_B3) CON2.B4(_IO_AB:IO_B4) CON2.B5(_IO_AB:IO_B5) CON2.B7(_IO_AB:IO_B7) CON2.B18(_IO_AB:IO_B18) CON2.B21(_IO_AB:IO_B21) CON2.B24(_IO_AB:IO_B24) CON2.B27(_IO_AB:IO_B27) CON2.B31(_JTAG:JTAG_TCK_B31) CON2.C1(_PWR:USB_5V_C1) CON2.C3(_IO_CD:IO_C3) CON2.C4(_IO_CD:IO_C4) CON2.C5(_IO_CD:IO_C5) CON2.C9(_IO_CD:IO_C9) CON2.C11(_IO_CD:IO_C11) CON2.C12(_IO_CD:IO_C12) CON2.C14(_IO_CD:IO_C14) CON2.C28(_IO_CD:IO_C28) CON2.C29(_IO_CD:IO_C29) CON2.C30(_IO_CD:IO_C30) CON2.C31(_JTAG:JTAG_TDO_C31) CON2.D1(_IO_CD:RESET_D1) CON2.D3(_IO_CD:IO_D3) CON2.D4(_IO_CD:IO_D4) CON2.D5(_IO_CD:IO_D5) CON2.D8(_IO_CD:IO_D8) CON2.D9(_IO_CD:IO_D9) CON2.D10(_IO_CD:IO_D10) CON2.D12(_IO_CD:IO_D12) CON2.D13(_IO_CD:IO_D13) CON2.D14(_IO_CD:IO_D14) CON2.D28(_IO_CD:IO_D28) CON2.D29(_IO_CD:IO_D29) CON2.D30(_IO_CD:IO_D30) CON2.D31(_JTAG:JTAG_TMS_D31)

### Buses
SW1,SW2,PIN8,PIN4,IO,CLK_SC,PIN6,RST,SHDN
DB0,DB1,DB2,DB3,DB4,DB5,DB6,DB7

### Notes on the sheet
- PIN8 was here in adapter version,
  but this is an MCU pin
- SC_IO was here in adapter version,
  but this is an MCU pin
- B16 | P7
- C16 | M7
- diff. adapter
- B15
- R7 | Input from power supply
- A14 | P8
- B14
- diff. adapter
- A13 | T8
- C13 | M9
- R9
- diff. adapter | B12
- T9
- E11
- D11
- F10
- A11
- C11
- B10
- D9
- F9
- diff. adapter | A9
- diff. adapter | C9 | L14
- A8 | T12
- B8
- F7 | R14
- E7
- A7
- C7 | N14
- P16
- D6 | N16 | diff. adapter
- R16 | diff. adapter
- R15 | diff. adapter
- was GPIO2
- B5
- was GPIO1
- C5
- was GPIO0
- D5
- check, VREF!
- A4
- C4

## Library data of the parts
AD9708 = ad9708:AD7908: AD9708 8-Bit DAC with current output http://www.analog.com/static/imported-files/data_sheets/AD9708.pdf
C1-C13 C15-C19 C21-C23 CD1-CD6 CF+ CF- CIN CR1-CR6 = rcl:C-EU: CAPACITOR, European symbol
CN+ CN- CNG = socket_24243:24243: Multicomp 24.243 Series https://uk.farnell.com/multicomp/24-243-2/receptacle-20a-4mm-pcb-solder/dp/1698983
CON2 = usb-fpga-2:USB-FPGA-2
D1 D2 = diode:DIODE-: DIODE
DAC_OUT = con-coax:BU-SMA-V: FEMALE SMA CONNECTOR Radiall distributor RS 112-3794; OC_FARNELL: unknown; OC_NEWARK: unknown
DAC_OUT_GND TP2 TP3 TP_5V TP_GND TP_GND1 TP_GND2 TP_GNDA TP_GNDA1 TP_GNDB TP_IN TP_IN1 TP_OUT TP_OUT1 = testpad:TP: Test pad
DAC_T = pinhead:PINHD-2X2: PIN HEADER
GPIO GPIO2 SCIO = pinhead:PINHD-1X10: PIN HEADER
H1-H4 = holes:MOUNT-HOLE: MOUNTING HOLE with drill center marker
IC1 = ths3062:THS3062: THS3062 high bandwidth dual opamp https://www.ti.com/product/THS3062
IC2 = ad80xx:AD80XX: AD high bandwidth dual opamp
JP1 = jumper:JP4Q: JUMPER
JP2-JP6 = pinhead:PINHD-1X2: PIN HEADER
JP7 OP_VCC = pinhead:PINHD-1X3: PIN HEADER
L1 = SparkFun:INDUCTOR: Inductors Basic Inductor/Choke - 0603 and 1206. Footprints are not proven and vary greatly between part numbers.
LED1-LED4 = led:LED: LED OSRAM: - CHIPLED LG R971, LG N971, LY N971, LG Q971, LY Q971, LO R971, LY R971 LH N974, LH R974 LS Q976, LO Q976, LY Q976 LO Q996 - Hyper CHIPLED LW Q18S LB Q993, LB Q99A, LB R99A - SideLED LS A670, LO A670, LY A670, LG A670, LP A670 LB A673, LV A673, LT A673, LW A673 LH A674 LY A675 LS A676, LA A676, LO A676, LY A676, LW A676 LS A679, LY A679, LG A679 - Hyper Micro SIDELED® LS Y876, LA Y876, LO Y876, LY Y876 LT Y87S - SmartLED LW L88C, LW L88S LB L89C, LB L89S, LG L890 LS L89K, LO L89K, LY L89K LS L896, LA L896, LO L896, LY L896 - TOPLED LS T670, LO T670, LY T670, LG T670, LP T670 LSG T670, LSP T670, LSY T670, LOP T670, LYG T670 LG T671, LOG T671, LSG T671 LB T673, LV T673, LT T673, LW T673 LH T674 LS T676, LA T676, LO T676, LY T676, LB T676, LH T676, LSB T676, LW T676 LB T67C, LV T67C, LT T67C, LS T67K, LO T67K, LY T67K, LW E67C LS E67B, LA E67B, LO E67B, LY E67B, LB E67C, LV E67C, LT E67C LW T67C LS T679, LY T679, LG T679 LS T770, LO T770, LY T770, LG T770, LP T770 LB T773, LV T773, LT T773, LW T773 LH T774 LS E675, LA E675, LY E675, LS T675 LS T776, LA T776, LO T776, LY T776, LB T776 LHGB T686 LT T68C, LB T68C - Hyper Mini TOPLED® LB M676 - Mini TOPLED Santana® LG M470 LS M47K, LO M47K, LY M47K Source: http://www.osram.convergy.de LUXEON: - LUMILED® LXK2-PW12-R00, LXK2-PW12-S00, LXK2-PW14-U00, LXK2-PW14-V00 LXK2-PM12-R00, LXK2-PM12-S00, LXK2-PM14-U00 LXK2-PE12-Q00, LXK2-PE12-R00, LXK2-PE12-S00, LXK2-PE14-T00, LXK2-PE14-U00 LXK2-PB12-K00, LXK2-PB12-L00, LXK2-PB12-M00, LXK2-PB14-N00, LXK2-PB14-P00, LXK2-PB14-Q00 LXK2-PR12-L00, LXK2-PR12-M00, LXK2-PR14-Q00, LXK2-PR14-R00 LXK2-PD12-Q00, LXK2-PD12-R00, LXK2-PD12-S00 LXK2-PH12-R00, LXK2-PH12-S00 LXK2-PL12-P00, LXK2-PL12-Q00, LXK2-PL12-R00 Source: www.luxeon.com KINGBRIGHT: KA-3528ASYC Source: www.kingbright.com
R1-R12 R20 R+ R- R_GND1 R_LED1-R_LED4 RADJ RF RF2 RF+ RF- RFB+ RFB- RFI RG RG2 RGI RL1 RL2 RO RS1 RS2 RT = rcl:R-EU_: RESISTOR, European symbol
R_POT = rcl:POTENTIOMETER_: Potentiometer
SJ1 SJ2 = jumper:SJ: SMD solder JUMPER
U1 = ad9215bruz:AD9215BRUZ
U$1 = mic5209:MIC5209
U$2-U$5 = DMG1012UW:DMG1012UW: NPN DMG1012UW Pin 1 = Gate Pin 2 = Source Pin 3 = Drain Datasheet: https://www.diodes.com/assets/Datasheets/ds31859.pdf
U$6 = xppower-IAS01:IAS0105D09: XP Power IAS01 Series DC-DC Converter Dual unregulated output ±10% input range 4.5 - 5.5V IN, +-9V @ +-56 mA Max. cap. load 470 uF https://www.xppower.com/portals/0/pdfs/SF_IAS01.pdf https://uk.farnell.com/xp-power/ias0105d09/dc-dc-converter-2-o-p-1w/dp/3281064
U$7 = ad8138:AD8138
U$18 = XC6206:XC6206: XC6206 series LDO https://uk.farnell.com/torex/xc6206p302mr/v-reg-ldo-0-25a-3v-smd-sot-23/dp/8796963 http://www.farnell.com/datasheets/2012663.pdf
X1 = con-coax-sma-adapted:BU-SMA-V: FEMALE SMA CONNECTOR Radiall distributor RS 112-3794; OC_FARNELL: unknown; OC_NEWARK: unknown

## Board
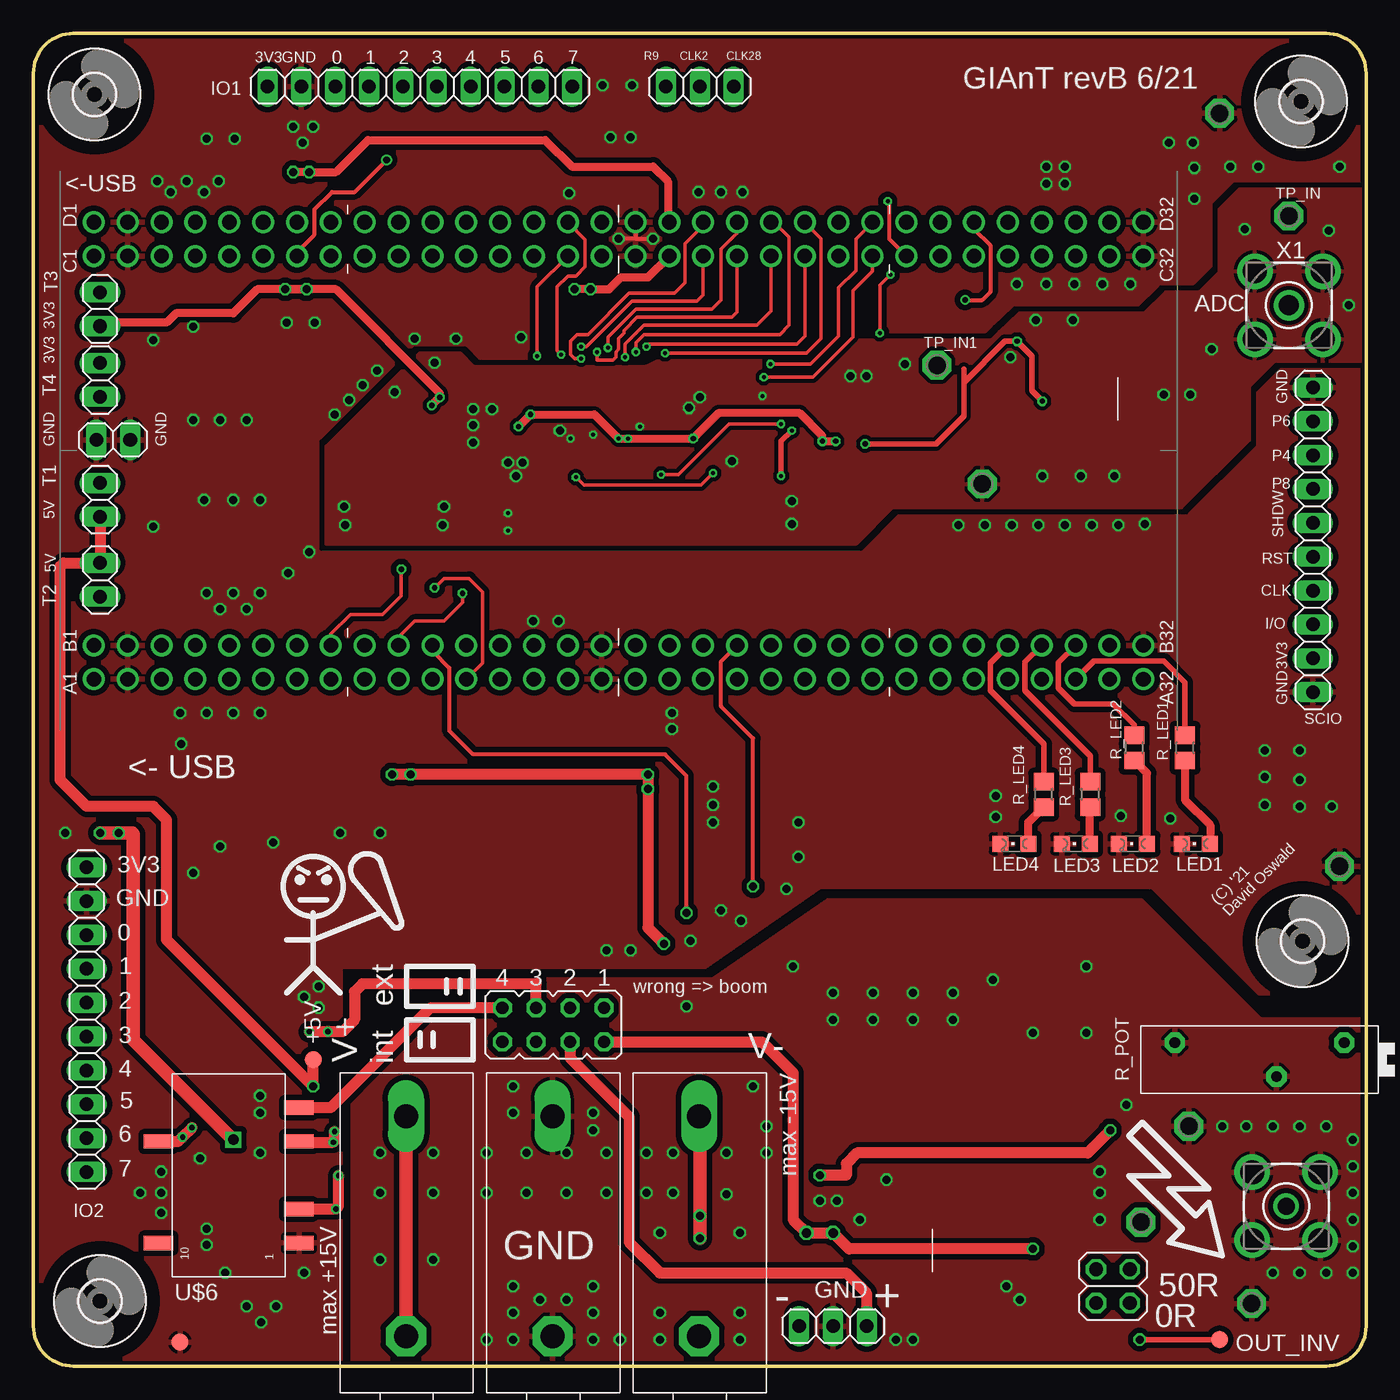
[diagram p5: board, top side]
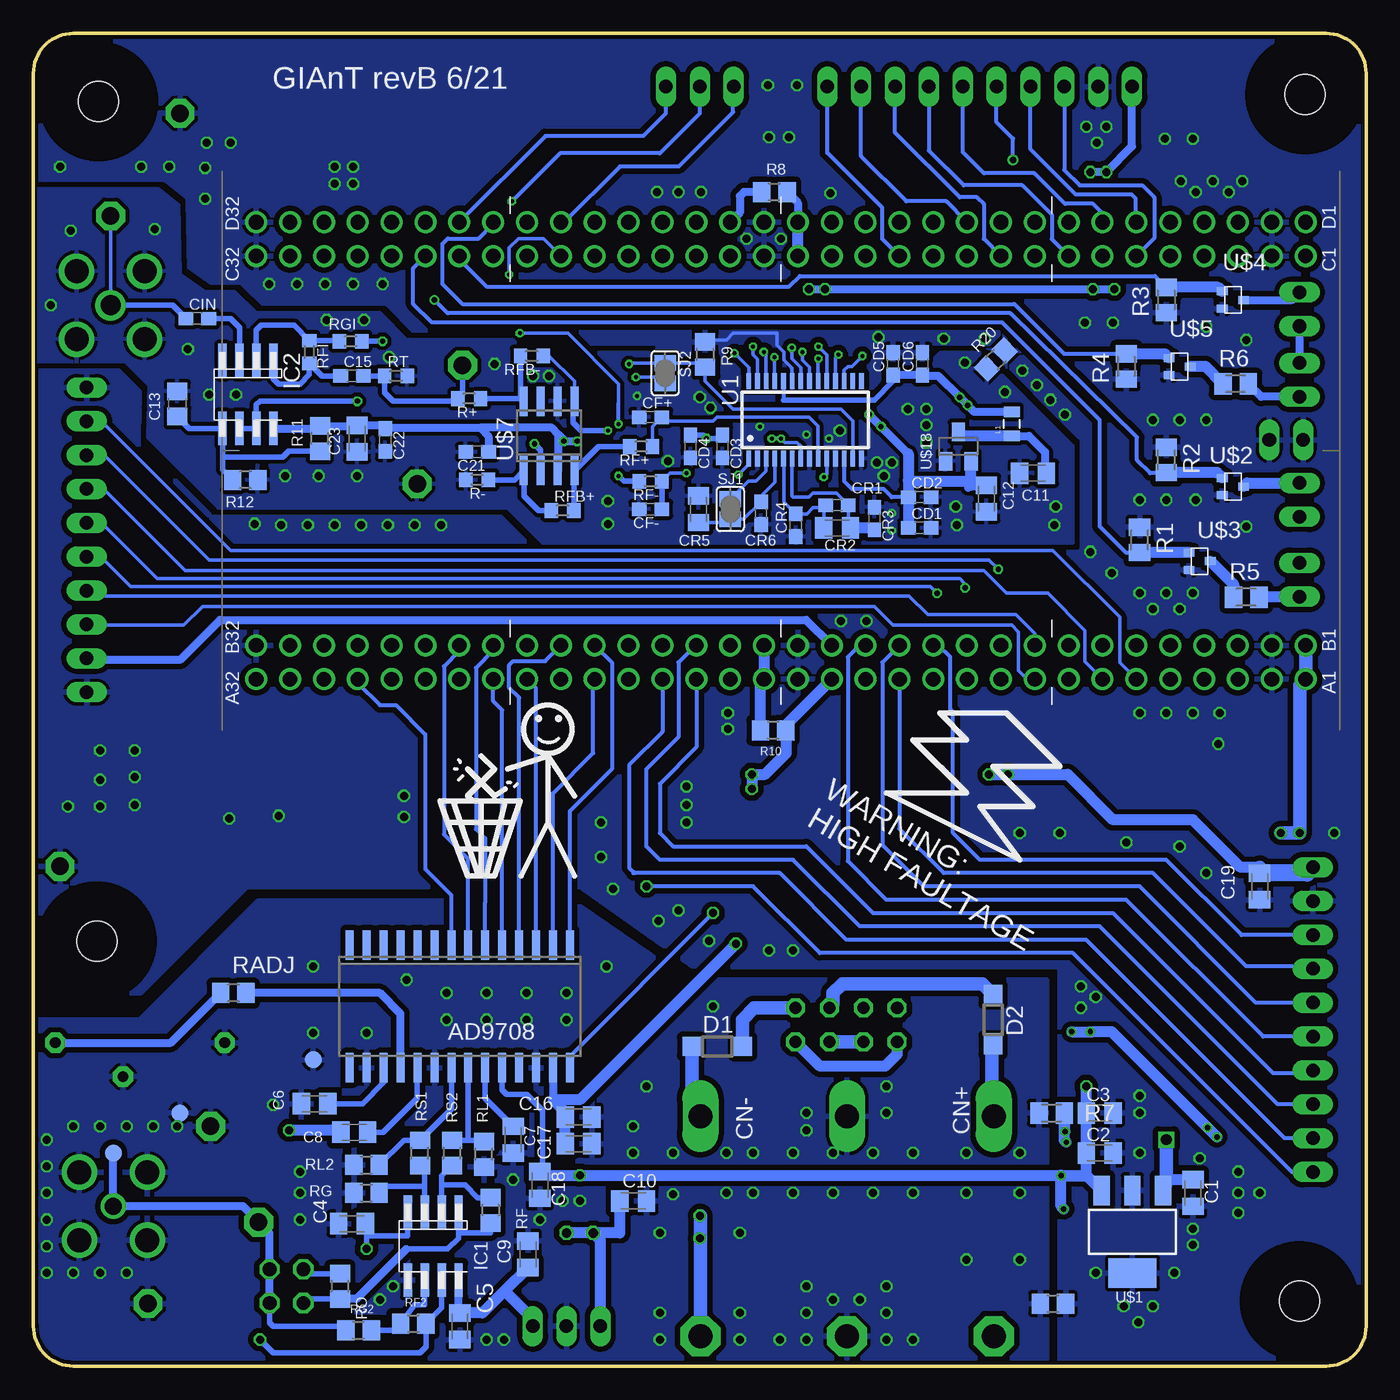
[diagram p6: board, bottom side, seen from below]

Size 100 x 100 mm. Coordinates in mm from the lower left corner, seen from the top.
Outline: 3,0 97,0 arc90 100,3 100,97 arc90 97,100 3,100 arc90 0,97 0,3 arc90 3,0
Copper layers (1*16): Top 0.035mm / dielectric 1.5mm / Bottom 0.035mm
Design rules "watterott_dirt_cheap_dirty_boards.v1": minimum track width 0.15mm, minimum drill 0.3mm, track to track 0.15mm, track to pad 0.15mm, pad to pad 0.15mm, via to via 0.15mm, smd to smd 0mil, copper to edge 0.3mm, drill to drill 10mil, minimum pad ring 10mil, minimum via ring 6mil, stop-mask expansion 2mil, vias tented up to drill 25mil, thermal gap 10mil
Milling: 8 lines

### Footprints (pad centres in the part's own frame; a part is rotated, then mirrored left to right if it is on the bottom)
SO28W = smd 0.6 x 2.2: 1 -8.255,-4.6; 2 -6.985,-4.6; 3 -5.715,-4.6; 4 -4.445,-4.6; 5 -3.175,-4.6; 6 -1.905,-4.6; 7 -0.635,-4.6; 8 0.635,-4.6; 9 1.905,-4.6; 10 3.175,-4.6; 11 4.445,-4.6; 12 5.715,-4.6; 13 6.985,-4.6; 14 8.255,-4.6; 15 8.255,4.6; 16 6.985,4.6; 17 5.715,4.6; 18 4.445,4.6; 19 3.175,4.6; 20 1.905,4.6; 21 0.635,4.6; 22 -0.635,4.6; 23 -1.905,4.6; 24 -3.175,4.6; 25 -4.445,4.6; 26 -5.715,4.6; 27 -6.985,4.6; 28 -8.255,4.6
C0805K = smd 1.3 x 1.6: 1 -1,0; 2 1,0
C0805 = smd 1.3 x 1.5: 1 -0.95,0; 2 0.95,0
C0603 = smd 1.1 x 1: 1 -0.85,0; 2 0.85,0
24_243 = drill 1.8 long: P$1 3.246,-6.05 | drill 1.8 pad 3 octagon: P$2 19.754,-6.05
USB-FPGA-2-THT = drill 1.1: A1 2.54,2.54; A2 5.08,2.54; A3 7.62,2.54; A4 10.16,2.54; A5 12.7,2.54; A6 15.24,2.54; A7 17.78,2.54; A8 20.32,2.54; A9 22.86,2.54; A10 25.4,2.54; A11 27.94,2.54; A12 30.48,2.54; A13 33.02,2.54; A14 35.56,2.54; A15 38.1,2.54; A16 40.64,2.54; A17 43.18,2.54; A18 45.72,2.54; A19 48.26,2.54; A20 50.8,2.54; A21 53.34,2.54; A22 55.88,2.54; A23 58.42,2.54; A24 60.96,2.54; A25 63.5,2.54; A26 66.04,2.54; A27 68.58,2.54; A28 71.12,2.54; A29 73.66,2.54; A30 76.2,2.54; A31 78.74,2.54; A32 81.28,2.54; B1 2.54,5.08; B2 5.08,5.08; B3 7.62,5.08; B4 10.16,5.08; B5 12.7,5.08; B6 15.24,5.08; B7 17.78,5.08; B8 20.32,5.08; B9 22.86,5.08; B10 25.4,5.08; B11 27.94,5.08; B12 30.48,5.08; B13 33.02,5.08; B14 35.56,5.08; B15 38.1,5.08; B16 40.64,5.08; B17 43.18,5.08; B18 45.72,5.08; B19 48.26,5.08; B20 50.8,5.08; B21 53.34,5.08; B22 55.88,5.08; B23 58.42,5.08; B24 60.96,5.08; B25 63.5,5.08; B26 66.04,5.08; B27 68.58,5.08; B28 71.12,5.08; B29 73.66,5.08; B30 76.2,5.08; B31 78.74,5.08; B32 81.28,5.08; C1 2.54,34.29; C2 5.08,34.29; C3 7.62,34.29; C4 10.16,34.29; C5 12.7,34.29; C6 15.24,34.29; C7 17.78,34.29; C8 20.32,34.29; C9 22.86,34.29; C10 25.4,34.29; C11 27.94,34.29; C12 30.48,34.29; C13 33.02,34.29; C14 35.56,34.29; C15 38.1,34.29; C16 40.64,34.29; C17 43.18,34.29; C18 45.72,34.29; C19 48.26,34.29; C20 50.8,34.29; C21 53.34,34.29; C22 55.88,34.29; C23 58.42,34.29; C24 60.96,34.29; C25 63.5,34.29; C26 66.04,34.29; C27 68.58,34.29; C28 71.12,34.29; C29 73.66,34.29; C30 76.2,34.29; C31 78.74,34.29; C32 81.28,34.29; D1 2.54,36.83; D2 5.08,36.83; D3 7.62,36.83; D4 10.16,36.83; D5 12.7,36.83; D6 15.24,36.83; D7 17.78,36.83; D8 20.32,36.83; D9 22.86,36.83; D10 25.4,36.83; D11 27.94,36.83; D12 30.48,36.83; D13 33.02,36.83; D14 35.56,36.83; D15 38.1,36.83; D16 40.64,36.83; D17 43.18,36.83; D18 45.72,36.83; D19 48.26,36.83; D20 50.8,36.83; D21 53.34,36.83; D22 55.88,36.83; D23 58.42,36.83; D24 60.96,36.83; D25 63.5,36.83; D26 66.04,36.83; D27 68.58,36.83; D28 71.12,36.83; D29 73.66,36.83; D30 76.2,36.83; D31 78.74,36.83; D32 81.28,36.83
SOD123 = smd 1.4 x 1.4: A 1.9,0; C -1.9,0
BU-SMA-V = drill 1.27: 1 0,0 | drill 1.778: 2 -2.55,2.55; 3 2.55,2.55; 4 2.55,-2.55; 5 -2.55,-2.55
B1,27 = smd 1.27 x 1.27: TP 0,0
2X02 = drill 1.016 octagon: 1 -1.27,-1.27; 2 -1.27,1.27; 3 1.27,-1.27; 4 1.27,1.27
1X10 = drill 1.016 long: 1 -11.43,0; 2 -8.89,0; 3 -6.35,0; 4 -3.81,0; 5 -1.27,0; 6 1.27,0; 7 3.81,0; 8 6.35,0; 9 8.89,0; 10 11.43,0
3,0 = hole 3: 0,0
SO08 = smd 0.635 x 2.54: 1 -1.905,-2.54; 2 -0.635,-2.54; 3 0.635,-2.54; 4 1.905,-2.54; 5 1.905,2.54; 6 0.635,2.54; 7 -0.635,2.54; 8 -1.905,2.54
JP4Q = drill 0.914 octagon: 1 -3.81,-1.27; 2 -3.81,1.27; 3 -1.27,-1.27; 4 -1.27,1.27; 5 1.27,-1.27; 6 1.27,1.27; 7 3.81,-1.27; 8 3.81,1.27
1X02 = drill 1.016 long: 1 -1.27,0; 2 1.27,0
1X03 = drill 1.016 long: 1 -2.54,0; 2 0,0; 3 2.54,0
0805 = smd 0.8 x 1.2: 1 -0.9,0; 2 0.9,0
CHIPLED_0805 = smd 1.2 x 1.2: A 0,-1.05; C 0,1.05
M0805 = smd 1.3 x 1.6: 1 -0.95,0; 2 0.95,0
R0805 = smd 1.3 x 1.5: 1 -0.95,0; 2 0.95,0
R0603 = smd 1 x 1.1: 1 -0.85,0; 2 0.85,0
PT-SPIN = drill 0.813 pad 1.524 octagon: 1 -6.35,-1.27; 2 6.35,-1.27; 3 -1.27,1.27
SJ = smd 1.168 x 1.6: 1 -0.762,0; 2 0.762,0
P1-13 = drill 1.321 pad 2.159 octagon: TP 0,0
TSSOP28 = smd 0.35 x 1.2: 1 -4.225,-2.9; 2 -3.575,-2.9; 3 -2.925,-2.9; 4 -2.275,-2.9; 5 -1.625,-2.9; 6 -0.975,-2.9; 7 -0.325,-2.9; 8 0.325,-2.9; 9 0.975,-2.9; 10 1.625,-2.9; 11 2.275,-2.9; 12 2.925,-2.9; 13 3.575,-2.9; 14 4.225,-2.9; 15 4.225,2.9; 16 3.575,2.9; 17 2.925,2.9; 18 2.275,2.9; 19 1.625,2.9; 20 0.975,2.9; 21 0.325,2.9; 22 -0.325,2.9; 23 -0.975,2.9; 24 -1.625,2.9; 25 -2.275,2.9; 26 -2.925,2.9; 27 -3.575,2.9; 28 -4.225,2.9
SOT223-3 = smd 1.219 x 2.235: 1 0.229,-8.179; 2 2.54,-8.179; 3 4.851,-8.179 | smd 3.6 x 2.2: 4 2.54,-1.981
DMG1012UW1-SMT323 = smd 0.6 x 0.8: 1 -0.65,-0.8; 2 0.65,-0.8; 3 0,0.8
SMD-DIP10 = smd 1.067 x 2.184: P$1 2.54,-9.525; P$2 5.08,-9.525; P$4 10.16,-9.525; P$5 12.7,-9.525; P$7 10.16,1.016; P$10 2.54,1.016
SOIC8 = smd 0.6 x 2.2: 1 -1.905,-2.6; 2 -0.635,-2.6; 3 0.635,-2.6; 4 1.905,-2.6; 5 1.905,2.6; 6 0.635,2.6; 7 -0.635,2.6; 8 -1.905,2.6
SOT23 = smd 1 x 1.4: 1 -0.95,-1.1; 2 0.95,-1.1; 3 0,1.1
BU-SMA-V' = drill 1.524: 1 0,0 | drill 1.778: 2 -2.55,2.55; 3 2.55,2.55; 4 2.55,-2.55; 5 -2.55,-2.55

### Placement (x,y rotation side)
AD9708  68,27 180 bottom
C1  13,13 270 bottom
C2  20,16 0 bottom
C3  20,19 0 bottom
C4  76.1,10.7 180 bottom
C5  68,3 270 bottom
C6  78.9,19.7 180 bottom
C7  64,17 270 bottom
C8  75.92,17.55 0 bottom
C9  62.9,8.4 90 bottom
C10  55,12.4 180 bottom
C11  25,67 180 bottom
C12  28.5,65.1 270 bottom
C13  89.2,72.2 90 bottom
C15  76.1,74.3 0 bottom
C16  59.1,18.7 0 bottom
C17  59.1,16.7 0 bottom
C18  62,13.6 270 bottom
C19  8,36 270 bottom
C21  66.7,68.6 180 bottom
C22  73.6,69.5 270 bottom
C23  75.7,69.6 90 bottom
CD1  33.5,62.9 0 bottom
CD2  33.5,65.2 0 bottom
CD3  48.3,69 270 bottom
CD4  50.7,69 270 bottom
CD5  35.5,75.2 90 bottom
CD6  33.3,75.2 90 bottom
CF+  53.7,71.2 0 bottom
CF-  53.7,64.3 180 bottom
CIN  87.7,78.6 0 bottom
CN+  34,22 270 top
CN-  56,22 270 top
CNG  45,22 270 top
CON2  2,49 0 top
CR1  39.7,64.6 0 bottom
CR2  39.7,62.9 0 bottom
CR3  36.9,63.6 270 bottom
CR4  42.8,63.1 90 bottom
CR5  50.1,64.3 270 bottom
CR6  45.4,64 90 bottom
D1  48.7,24 0 bottom
D2  28,26 270 bottom
DAC_OUT  94,12 0 top
DAC_OUT_GND  79,23 180 bottom
DAC_T  81,6 270 top
GPIO  29,96 0 top
GPIO2  4,26 270 top
H1  4.6,95.4 0 top
H2  5.01,4.88 0 top
H3  95.12,94.88 0 top
H4  95.23,31.88 0 top
IC1  70,9 180 bottom
IC2  83.9,72.9 180 bottom
JP1  39,25.6 180 top
JP2  5,65 270 top
JP3  5,59 90 top
JP4  5,79.3 270 top
JP5  5,74 90 top
JP6  6,69.5 180 top
JP7  50,96 0 top
L1  26.6,70.7 90 bottom
LED1  87.2,39.2 90 top
LED2  82.5,39.2 90 top
LED3  78.2,39.2 90 top
LED4  73.6,39.2 90 top
OP_VCC  60,3 0 top
R1  17,62 270 bottom
R2  15,68 270 bottom
R3  15,80 90 bottom
R4  18,75 90 bottom
R5  9,57.7 0 bottom
R6  9.8,73.7 0 bottom
R7  23.6,19 180 bottom
R8  44.4,88.1 0 bottom
R9  49.6,75.9 270 bottom
R10  44.5,47.7 180 bottom
R11  78.5,69.6 90 bottom
R12  84.1,66.5 180 bottom
R20  27.79,75.53 45 bottom
R+  67.3,72.6 180 bottom
R-  66.7,66.5 180 bottom
R_GND1  23.5,4.7 0 bottom
R_LED1  86.4,46.4 90 top
R_LED2  82.6,46.4 90 top
R_LED3  79.3,42.9 90 top
R_LED4  75.8,42.9 90 top
R_POT  92,23 180 top
RADJ  85,28 180 bottom
RF  65.7,11.7 270 bottom
RF2  71.5,3.2 0 bottom
RF+  54.4,69 180 bottom
RF-  53.7,66.4 180 bottom
RFB+  60.3,64.2 0 bottom
RFB-  62.6,75.8 180 bottom
RFI  79.3,76.1 270 bottom
RG  75,13 0 bottom
RG2  75.6,2.7 0 bottom
RGI  76.2,76.9 180 bottom
RL1  66.2,15.9 90 bottom
RL2  75,15.1 0 bottom
RO  77,6 270 bottom
RS1  71,16 90 bottom
RS2  68.6,16 270 bottom
RT  72.8,74.3 0 bottom
SCIO  96,62 90 top
SJ1  47.7,64.3 90 bottom
SJ2  52.6,74.5 270 bottom
TP2  83.1,10.8 0 top
TP3  86.7,18 0 top
TP_5V  21,23 0 top
TP_GND  11,1.8 0 top
TP_GND1  89,19 0 bottom
TP_GND2  91.4,4.7 0 top
TP_GNDA  98,37.5 0 top
TP_GNDA1  71.2,66.2 0 top
TP_GNDB  89,94 0 top
TP_IN  94.2,86.3 0 top
TP_IN1  67.8,75.1 0 top
TP_OUT  94,16 0 bottom
TP_OUT1  89,2 0 top
U1  42.1,71 0 bottom
U$1  15,5 180 bottom
U$2  10,66 270 bottom
U$3  12.5,60.4 270 bottom
U$4  10,80 270 bottom
U$5  14,75 270 bottom
U$6  10.4,6.7 90 top
U$7  61.3,69.8 0 bottom
U$18  30.6,69 0 bottom
X1  BU-SMA-V  [BU-SMA-V']  94.2,79.6 0 top

### Tracks (layer width: path | path; a pad name or v marks a point on that pad's centre or on a via)
+5V  (via drill 0.4, 0.6)
  Top 0.813: v80.8,17.7 79.1,16 61.8,16 61,15.2 61,14.33 v59,14.33 | TP_5V.TP v21,21 10,32 10,41 9,42 4,42 2,44 2,60 2.27,60.27 JP3.2 JP2.2 | U$6.P$2 19.95,11.8 v22.7,11.8 22.9,12 v22.9,14.3
  Bottom 0.406: AD9708.24 64.83,20.73 64.5,20.4 63,20.4 61.8,19.2 61.8,14.8 C18.1
  Bottom 0.813: U$1.3 21,14.33 | 21,14.33 C2.1 C3.1 v21,21 | 61.8,14.8 61.33,14.33 v59,14.33 22.9,14.33 | 22.9,14.33 21,14.33 | C8.1 77.07,17.7 v80.8,17.7 | v22.7,11.8 22.9,12 v22.9,14.3 | v22.9,14.3 22.9,14.33 | v22.9,14.3 21.1,14.3
+5V/1  (via drill 0.6)
  Top 0.813: v26.9,44.4 v28.3,44.4 v46.1,44.4 v46.1,43.3 46.1,32.9 v47.3,31.7
  Bottom 0.406: AD9708.27 61.1,22.32 61,22.21 | 60.1,19.1 C16.1
  Bottom 0.61: 61,22.21 61,20
  Bottom 0.813: v47.3,31.7 59,20 61,20 60.1,19.1 | C17.1 C16.1 | 8,37.43 9.43,37.43 13,41 19,41 22.4,44.4 v26.9,44.4 v28.3,44.4 | CON2.A15 43.55,48.09 R10.1 43.5,47.65 43.5,46 45.1,44.4 v46.1,44.4 v46.1,43.3
  Bottom 1.016: C19.1 8,37.43
  Bottom 1.27: GPIO2.1 4.43,37 C19.1
+5V/2  (via drill 0.6)
  Top 0.61: v19.5,89.6 v20.7,89.6 22.7,89.6 25.1,92 38.4,92 40.4,90 46.5,90 47.6,88.9 47.6,85.95 CON2.D18
  Bottom 0.61: GPIO.1 17.57,91.53 v19.5,89.6 v20.7,89.6 | R8.1 46.7,88.1 47,87.8 47,86.55 CON2.D18
+5V/3  (via drill 0.4, 0.6)
  Top 0.61: v40.6,80.8 v41.8,80.8 43.2,80.8 44.1,81.7 46.13,81.7 CON2.C18 | v18.9,80.8 16.8,80.8 15,79 10.7,79 10,78.3 5.27,78.3 JP4.2 | v18.9,80.8 v20.5,80.8 | v18.9,80.8 22.7,80.8 30.5,73 v30.5,72.69 v29.89,72.09
  Bottom 0.254: U1.24 43.8,73.83
  Bottom 0.305: U1.24 43.73,72.5
  Bottom 0.406: 43.73,72.5 36.9,72.5 35.5,73.9 CD5.1 | 33.25,74.4 CD6.1
  Bottom 0.61: v41.8,80.8 v40.6,80.8 v20.5,80.8 v18.9,80.8 | L1.2 29.4,71.6 v30.5,72.69 32.1,74.3 33.25,74.3 CD6.1 CD5.1 | JP5.2 JP4.2
+9V  (via drill 0.4)
  Top 0.813: U$6.P$7 10.86,16.86 v11.2,17.2 v11.9,17.9 | JP1.5 37.73,28.7 24.7,28.7 24.1,28.1 24.1,26 23.2,25.1 v22.1,25.1 v20.7,25.1
  Bottom 0.813: v11.2,17.2 v11.9,17.9 19.1,25.1 20.5,25.1 v20.7,25.1 v22.1,25.1
-9V
  Top 0.813: JP1.7 29.77,26.87 22.3,19.4 U$6.P$5
ADC_CLK  (via drill 0.3)
  Top 0.254: v55.3,75.2 58.3,75.2 60.4,77.3 60.4,80.9 61.7,82.2 61.7,84.57 CON2.D24
  Bottom 0.254: U1.13 38.52,70.92 39.4,71.8 47.5,71.8 49.6,73.9 R9.2 49.91,75.26 SJ2.1 55.24,75.26 v55.3,75.2
ADC_CLK_FB  (via drill 0.3)
  Top 0.254: v54.8,74.2 58.5,74.2 61.5,77.2 61.5,80.7 62.96,82.16 CON2.C24
  Bottom 0.254: v54.8,74.2 53.06,74.2 SJ2.2
ADC_D0  (via drill 0.3)
  Top 0.254: CON2.C15 37.8,80.99 v37.8,75.8
  Bottom 0.254: U1.17 39.17,74.72 38.9,75 38.6,75 v37.8,75.8
ADC_D1  (via drill 0.3)
  Top 0.254: CON2.D15 41.4,84.53 41.4,82.5 40.7,81.8 40.1,81.8 39.3,81 39.3,76.2 v39.6,75.9
  Bottom 0.254: U1.18 39.83,75.67 v39.6,75.9
ADC_D2  (via drill 0.3)
  Top 0.254: CON2.C19 50.26,80.36 49.8,79.9 44.9,79.9 41.5,76.5 v41.1,76.5
  Bottom 0.254: U1.19 40.48,75.88 v41.1,76.5
ADC_D3  (via drill 0.3)
  Top 0.254: CON2.D19 50.26,85.56 48.9,84.2 48.9,81.3 48.1,80.5 44.7,80.5 41.6,77.4 40.8,77.4 40.3,76.9 40.3,75.9 40.6,75.6 v41.1,75.6 41,75.7
  Bottom 0.254: U1.20 41.12,75.58 v41.1,75.6
ADC_D4  (via drill 0.3)
  Top 0.254: CON2.C20 52.8,79.1 52.4,78.7 45.3,78.7 44.3,77.7 44.3,77.5 43.9,77.1 43.9,76.3 43.7,76.1 43.7,75.7 43.5,75.5 42.3,75.5 v42.3,76.1
  Bottom 0.254: U1.21 41.77,74.97 42.3,75.5 v42.3,76.1
ADC_D5  (via drill 0.3)
  Top 0.254: CON2.D20 52.8,85 51.6,83.8 51.6,80 50.9,79.3 45.2,79.3 43.1,77.2 v43.1,76.4
  Bottom 0.254: U1.22 42.42,74.92 43.1,75.6 v43.1,76.4
ADC_D6  (via drill 0.3)
  Top 0.254: CON2.C21 55.34,79.14 54.3,78.1 45.8,78.1 44.4,76.7 v44.4,75.7
  Bottom 0.254: U1.25 44.4,73.92 v44.4,75.7
ADC_D7  (via drill 0.3)
  Top 0.254: CON2.D21 55.57,85.83 56.7,84.7 56.7,78.1 56,77.4 45.8,77.4 45.2,76.8 v45.2,76.1
  Bottom 0.254: U1.26 45.02,76.1 v45.2,76.1
ADC_D8  (via drill 0.3)
  Top 0.254: CON2.C22 57.9,83.27 57.9,77.3 57.3,76.7 46.2,76.7 v46,76.5
  Bottom 0.254: U1.27 45.67,75.58 46,75.9 v46,76.5
ADC_D9  (via drill 0.3)
  Top 0.254: CON2.D22 59.1,84.61 59.1,77.1 58,76 v47.4,76
  Bottom 0.254: U1.28 46.33,74.92 v47.4,76
ADC_IN+
  Bottom 0.254: U1.9 41.12,70.53 41.8,71.2 48.7,71.2 49,70.9 52.55,70.9 CF+.2 53.55,70.5 RF+.1
ADC_IN-  (via drill 0.3)
  Top 0.254: v51,67 50.1,66.1 41.3,66.1 v40.7,66.7
  Bottom 0.254: U1.10 40.48,66.92 v40.7,66.7 | v51,67 52.25,67 RF-.1
  Bottom 0.406: RF-.1 CF-.1
ADC_OR  (via drill 0.3)
  Top 0.254: v47.1,66.9 48.4,66.9 52.2,70.7 v56.1,70.7 | v63.5,77.5 63.5,81.1 v64.3,81.9
  Bottom 0.254: U1.1 46.33,67.67 v47.1,66.9 | v63.5,77.5 59.9,77.5 56.1,73.7 56.1,72.2 | v64.3,81.9 64.3,83.9 63.6,84.6 61.73,84.6 CON2.C23
  Bottom 0.305: v56.1,70.7 56.1,72.2
ADC_V_REF
  Bottom 0.254: U1.4 44.38,66.33 45.4,65.3 CR6.2 46.71,63.54 SJ1.1 47.94,63.3 CR5.2
  Bottom 0.406: 49.76,63.64 CR5.2
AMP_IN+
  Bottom 0.406: R+.1 63.41,72.6 | 63.41,72.6 U$7.8 | 63.41,72.6 63.45,72.64 RFB-.2
AMP_IN-
  Bottom 0.406: RFB+.1 62.1,64.2 63.2,65.3 U$7.1 63.91,66.5 R-.1
AMP_OUT+
  Bottom 0.406: RFB+.2 59.45,67.14 U$7.4 57.59,69 RF+.2
AMP_OUT-  (via drill 0.3)
  Top 0.406: v56.9,70.2 56.1,69.4 v56.1,66.8
  Bottom 0.254: RFB-.1 61.3,75.8 59.4,73.9 U$7.5
  Bottom 0.406: U$7.5 59.5,72.3 59.5,70.8 58.9,70.2 v56.9,70.2 | v56.1,66.8 55.7,66.4 RF-.2
CLK_SC
  Bottom 0.254: CON2.B9 24.86,54.96 26.3,56.4 32.9,56.4 34.3,57.8 95.61,57.8 SCIO.4
COMP1
  Bottom 0.406: C8.2 73.75,17.55 71.2,20.1 71.2,22.38 AD9708.19
COMP2
  Bottom 0.406: C7.1 66.09,20.09 AD9708.23
DAC_CLK  (via drill 0.6)
  Top 0.305: v49,34 49,44.3 47.4,45.9 33,45.9 31.2,47.7 31.2,52.4 29.94,53.66 CON2.B11
  Bottom 0.305: AD9708.28 59.74,23.25 v49,34
DAC_OUT_NET
  Bottom 0.406: RG2.1 76.85,3 82,3 82.27,3.27 DAC_T.4
  Bottom 0.61: DAC_T.4 DAC_T.2 82.27,10 82.3,10 TP2.TP 83.1,10.83 84.27,12 DAC_OUT.1 TP_OUT.TP
DB0
  Bottom 0.305: CON2.A29 75.66,51.26 74,49.6 72.8,49.6 70.6,47.4 70.6,37.3 68.64,35.34 AD9708.8
DB1
  Bottom 0.305: CON2.B26 68.04,53.66 69.2,52.5 69.2,39.9 67.36,38.06 AD9708.7
DB2
  Bottom 0.305: AD9708.6 66.09,34.8 66.1,34.8 66.1,39.6 66.8,40.3 66.8,52.4 65.5,53.7 CON2.B25
DB3
  Bottom 0.305: AD9708.5 64.83,49.23 65.5,49.9 CON2.A25
DB4
  Bottom 0.305: AD9708.4 63.55,50.16 64.3,50.9 64.3,52.6 64,52.9 61.6,52.9 CON2.B23
DB5
  Bottom 0.305: AD9708.3 62.28,50.87 CON2.A24
DB6
  Bottom 0.305: AD9708.2 61.02,42.98 58,46 58,51.42 CON2.A22
DB7
  Bottom 0.305: AD9708.1 59.74,41.66 56.6,44.8 56.6,52.8 CON2.B22
FPGA_R9
  Bottom 0.305: JP7.1 47.5,95.96 47.5,94.1 51.6,90 56,90 60.17,85.83 CON2.D23
FSADJ
  Bottom 0.61: AD9708.18 72.44,26.45 74,28 RADJ.1
GCLK2  (via drill 0.3)
  Top 0.305: CON2.C25 64.2,84.59 64.2,87.3 v64.1,87.4
  Bottom 0.305: JP7.2 50,94 53,91 60.5,91 v64.1,87.4
GCLK28
  Bottom 0.305: JP7.3 52.54,94 54.24,92.3 61.57,92.3 CON2.D26
GND  (via drill 0.6)
  Top 0.305: CON2.D17 45.18,84.6 | 45.18,84.6 v46.5,84.6 | 45.18,84.6 v43.9,84.6
  Bottom 0.254: U1.23 43.08,74.88 43.7,75.5 43.7,76.1 44.2,76.6 44.2,77.5 47.5,77.5 48,77 49.45,77 R9.1
  other vias: 8,13 12.5,15.6 17,20.3 20.3,27.7 21.4,26.9 21.4,28.5 17.1,3.3 23,40 26,40 12,37 17,16 17,19 20.3,7 18.2,4.5 14.4,7 16,4.5 49.3,31.9 53.1,33.4 56.5,35.8 51.6,34.2 43,31.2 44.8,31.2 11.1,46.7 17,49 15,49 16,56.8 13,49 12.8,88.1 10.3,88.1 9.3,88.9 11.5,88.9 87,91.8 85.2,91.8 98,90 21,93 11,49 14,39 18,39.3 95,44 95,42 72.2,41.2 92.4,46.2 92.4,42.1 92.4,44.2 85.3,41.1 72.2,42.8 81.6,41.3 2.4,40 19,78.3 21.1,78.3 17,65 9,77 12,78 12,71 14,71 16,71 25.8,74.7 23.7,72.5 12.8,65 15,65 9,63 17,58 13,58 14,56.8 76,90 53.2,88.1 87.1,87.6 87.1,89.9 44.8,92.2 49.9,88.1 51.6,88.1 43.3,92.2 42.7,96.1 44.9,96.1 19.5,93 20.2,91.8 13,92.1 15.1,92.1 13.9,88.9 47.9,49 51,42.1 47.9,47.8 39.4,55.9 51,43.5 51,40.8 76,81.2 28.6,77.1 97.4,42 95,46.2 91.9,90 89.8,90 37.5,55.9 73.8,81.2 76,88.7 77.4,88.7 77.4,90 81.4,63.1 69.4,63.1 83.4,63.2 15,58 19.1,59.5 20.7,61.1 9.6,13 9.6,14.6 9.6,11.5 13,10.3 13,9.1 57.4,40.8 57.4,38.2 40.2,88 78.1,81.2 80.2,81.2 82.3,81.2 71.4,63.1 73.4,63.1 75.4,63.1 77.4,63.1 79.4,63.1 24.7,73.6 22.6,71.4 31.7,77.1 36.6,77.2
  pour Top (isolate 0.406, rank 2): 0,100 0,0 23,0 23,30 50.4,30 59,36 84,36 92,28 100,28 101,100
  pour Bottom (isolate 0.406, rank 2): 0,100 0,0 23,0 23,30 50.5,30 59,36 84,36 92,28 100,28 101,100
GND1  (via drill 0.6)
  other vias: 26,8 30,8 60,28 69,28 66,28 69,26 60,26 75,25 79,25 79,30 49,27 57,30 54,21 26,16 30,16 34,16 37,16 40,16 43,16 46,16 48,16 52,16 55,18 55,16 26,13 30,13 34,13 37,13 40,13 43,13 46,13 48,13 60.3,12.4 59,12.4 62,11 64,14 80,11 80,13 80,14.6 64.7,2 66,2 82,19.6 99,11 99,13 99,15 44,2 40,5 42,4 42,6 42,2 38,5 36,2 42,17.7 42,19 36,19 36,21 89.2,18 95,18 93,18 99,9 99,17 99,7 53,4 47,4 36,6 36,4 34,2 63,28 63,26 66,26 72,29 52,12.9 73,6 74,5 97,7 95,7 93,7 91,18 97,18 53,2 47,2 53,10 47,10
  pour Bottom (isolate 0.406): 24,29 51,29 59.6,34.9 83.1,34.9 92,26 100,26 100,0 24,0
  pour Top (isolate 0.406): 24,0 24,29 51,29 59.6,34.9 83.1,34.9 92,26 100,26 100,0
GND2  (via drill 0.3, 0.6)
  other vias: 23.4,63.1 33,70.6 56.9,63.2 97.2,85.2 90.9,85.3 30.1,75.3 27.1,73.1 23.3,64.5 33,71.8 33,69.3 61.3,74.3 62.5,74.3 73.3,75.7 56.9,64.9 50,72.7 49.2,71.9 39.5,70.2 35.6,67.8 36.7,67.8 52.4,67.9 36.2,66.8 42,69.9 45.5,70.5 40.3,69.6 88.4,76.3 98.7,79.6 75.2,78.5 78,78.5 84.8,72.9 75.7,66.8 78.6,66.8 81.1,66.8 65.4,75.2 34.4,71.8 30.8,64.5 30.7,63.1 35.6,64 35.6,62.7 54.7,72.8 86.8,72.9
  pour Bottom (isolate 0.305): 22,69 29,76 32,76 33,75 46,75 48,76 60,76 61,77 72,77 74,79 83.3,79 84.9,80.6 87.1,80.6 89,81.9 89.1,87.1 90.6,88.3 100,88.3 100.1,84.2 100.1,75.5 100,75.4 93.1,75.4 91.3,73.6 91.4,69.7 86.1,64.4 64.4,64.4 61.7,61.7 22,61.8
  pour Top (isolate 0.305): 22,61.7 22,69 29,76 32,76 33,75 46,75 48,76 60,76 61,77 71.9,77 72.5,77.6 74,79 83.4,79 85,80.6 87.5,80.6 89,82.1 89,86.8 90.5,88.3 100.4,88.3 100.4,75.4 93.1,75.4 91.2,73.5 91.2,69.5 86.1,64.4 64.4,64.4 61.7,61.7
GPIO0
  Bottom 0.305: GPIO.3 22.65,89.75 21.5,88.6 16.8,88.6 15.9,87.7 15.9,84.63 CON2.C6
GPIO1
  Bottom 0.305: GPIO.4 25.19,91.29 21.8,87.9 17.6,87.9 17.3,87.6 17.3,85.89 CON2.D6
GPIO2  (via drill 0.5)
  Top 0.305: CON2.C7 19.78,83.58 21.1,84.9 21.1,86.8 22.4,88.1 24.1,88.1 v26.5,90.5
  Bottom 0.305: v26.5,90.5 26.5,92.1 27.73,93.33 GPIO.5
GPIO2_0
  Bottom 0.305: GPIO2.3 9.35,32.35 15,38 29,38 31,40 31,49.1 31.2,49.3 31.2,53.2 32.08,54.08 CON2.B12
GPIO2_1
  Bottom 0.305: GPIO2.4 4.19,30 9,30 16,37 31.7,37 35.02,40.32 CON2.A13
GPIO2_2
  Bottom 0.305: GPIO2.5 8.27,27.27 17,36 33.2,36 36.3,39.1 36.3,52.8 CON2.B13
GPIO2_3
  Bottom 0.305: GPIO2.6 7.73,24.73 18,35 36,35 38.9,37.9 38.9,53.2 38.02,54.08 CON2.B14
GPIO2_4
  Bottom 0.305: 5.19,22.19 GPIO2.7 4.19,22 7,22 19,34 37,34 42,39 52,39 53,40 53,43.7 50.26,46.44 CON2.A19
GPIO2_5
  Bottom 0.305: GPIO2.8 6.65,19.65 20,33 38,33 43,38 53,38 54,39 54,44.8 51.6,47.2 51.6,52.8 50.32,54.08 CON2.B19
GPIO2_6
  Bottom 0.305: GPIO2.9 6.11,17.11 21,32 39,32 44,37 54.9,37 | 54.9,37 55,37 | CON2.A20 52.8,47.6 55.3,45.1 55.3,37.4 54.9,37
GPIO2_7  (via drill 0.6)
  Top 0.305: v54,36 54,47.1 51.6,49.5 51.6,52.88 CON2.B20
  Bottom 0.305: GPIO2.10 5.57,14.57 22,31 41,31 46,36 v54,36
GPIO3
  Bottom 0.254: GPIO.6 30.27,95.4
  Bottom 0.305: 30.27,95.4 30.27,91.1 28.67,89.5 24.9,89.5 22.6,87.2 20.5,87.2 19.8,86.5 19.8,85.85 CON2.D7
GPIO4
  Bottom 0.305: CON2.C8 23.6,84.57 23.6,86.4 25.8,88.6 30.2,88.6 32.81,91.21 GPIO.7
GPIO5
  Bottom 0.305: CON2.C10 28.7,84.59 28.7,87.2 29.2,87.7 30.5,87.7 35.35,92.55 GPIO.8
GPIO6
  Bottom 0.305: 37.89,94.81 GPIO.9 37.89,90.79 34.5,87.4 31.51,87.4 CON2.D11
GPIO7
  Bottom 0.305: CON2.C13 36.3,84.57 36.3,86.9 40.43,91.03 GPIO.10
IN_ADC_AMP
  Bottom 0.406: C15.2 RT.1 73.65,73.05 73,72.4 68.35,72.4 R+.2 67.8,72.95 TP_IN1.TP
IO
  Bottom 0.254: CON2.A9 25.44,51.54 26.1,52.2 26.1,55.1 26.6,55.6 35.5,55.6 36.9,57 87.3,57 88.7,55.6 95.95,55.6 SCIO.3
IOUTA
  Bottom 0.406: AD9708.22 67.36,16.95 RS2.1 66.3,16.95 arc90 RL1.2
IOUTB
  Bottom 0.406: AD9708.21 68.64,19.32 RS1.2 72.2,16.95 RL2.2
LED1_PIN
  Top 0.406: R_LED1.2 86.4,51.3 84.8,52.9 79.56,52.9 CON2.A30
LED2_PIN
  Top 0.406: R_LED2.2 82.6,48.1 81,49.7 78.1,49.7 76.9,50.9 76.9,52.78 CON2.B30
LED3_PIN
  Top 0.406: R_LED3.2 79.3,45.8 74.4,50.7 74.4,52.82 CON2.B29
LED4_PIN
  Top 0.406: R_LED4.2 75.8,46.7 71.8,50.7 71.8,52.76 CON2.B28
N$1
  Bottom 0.813: R10.2 45.45,51 | 45.45,51 45.45,51.27 CON2.A17 | CON2.B17 45.18,51.27 45.45,51
N$2
  Bottom 0.61: R8.2 42.64,87.29 CON2.D16
  Bottom 0.813: CON2.C16 CON2.D16
N$3
  Bottom 0.61: L1.1 25.3,69.8 24.1,68.6 24.1,67.1 C11.1
  Bottom 0.813: L1.1 30.3,69.8 U$18.3
N$4
  Bottom 0.254: U1.3 45.02,67.17 45.8,66.4 46.36,66.4 SJ1.2
N$5
  Bottom 0.254: CR2.2 38.85,63.05 CR1.2 39.75,65.5 41.5,65.5 41.8,65.2 43,65.2 43.08,65.28 U1.6
  Bottom 0.813: CR3.2 36.9,62.9 CR2.2
N$6
  Bottom 0.254: U1.5 43.7,68.08 43.7,64.85 CR4.2 41.95,63.95 41.5,64.4 40.75,64.4 CR1.1 40.7,64.45 CR2.1
N$7  (via drill 0.4)
  Top 0.813: U$6.P$4 19.98,16.8 v22.5,16.8 22.6,16.9 v22.6,17.6
  Bottom 0.813: v22.5,16.8 22.65,16.95 R7.1 | v22.6,17.6 22.6,19
N$8
  Bottom 0.254: X1.1 TP_IN.TP
  Bottom 0.406: X1.1 89.55,79.6 CIN.1
N$9
  Bottom 0.406: IC2.3 84.53,77.94 85.2,78.6 CIN.2
N$10
  Bottom 0.406: IC1.3 70.64,13.5 | 70.64,13.5 70.64,14.69 RS1.1 | RG.2 73.55,13.5 70.64,13.5
N$11
  Bottom 0.406: IC1.2 69.36,13.6 | 69.36,13.6 69.36,14.29 RS2.2 | RF.1 66.65,12.65 67.6,13.6 69.36,13.6
N$12
  Bottom 0.406: RF.2 65.7,10 68.09,10 | IC1.1 68.09,10 | 68.09,10 68.09,9.61 68.9,8.8 72,8.8 | RO.2 79.73,5.05 DAC_T.3
  Bottom 0.61: 72,8.8 75.75,5.05 RO.2
N$13
  Bottom 1.016: D2.C 28.8,28.7 39.3,28.7 40,28 40,27.14 JP1.3
N$14
  Bottom 0.813: U$3.3 9.95,58.65 R5.1
N$15
  Bottom 0.813: U$2.3 8.93,66.27 JP2.1
N$16
  Bottom 0.813: JP3.1 5.03,57.7 R5.2
N$17
  Bottom 1.016: D1.A 46.8,26 45.93,26.87 JP1.1
N$18
  Bottom 0.406: RO.1 79.73,6.95 DAC_T.1
N$19
  Bottom 0.61: R_POT.1 89.68,24.27 RADJ.2
N$20
  Bottom 0.813: R6.1 12.05,75 U$5.3
N$21
  Bottom 0.406: IC2.1 82,74.09 81.6,73.7 80,73.7 79.3,74.4 RFI.2 78.35,74.3 C15.1
N$22
  Bottom 0.61: U$4.3 5.57,80 JP4.1
N$23
  Bottom 0.61: JP5.1 7.88,72.73 R6.2
  Bottom 0.813: R6.2 8.82,73.73
N$24
  Bottom 0.406: IC1.6 70.64,4.6 71.4,4.6 RF2.1 72.95,2.7 RG2.2
N$25
  Bottom 0.406: IC2.2 83.27,77.73 82.9,78.1 80.45,78.1 RFI.1 77.1,76.95 RGI.2
N$33  (via drill 0.6)
  Top 0.406: TP_OUT1.TP v83,2
  Bottom 0.406: IC1.7 69.36,4.38 RF2.2 70.55,1.45 71,1 82,1 v83,2
N$34
  Top 0.61: LED2.A 83.55,44.5 R_LED2.1
N$35
  Top 0.61: R_LED1.1 86.4,42.5 88.3,40.6 88.3,39.25 LED1.A
N$50
  Top 0.61: LED3.A 79.25,41.9 R_LED3.1
N$51
  Top 0.61: LED4.A 74.65,40.8 R_LED4.1
PIN4  (via drill 0.4)
  Top 0.254: v27.6,59.8 27.6,57.8 26.2,56.4 23.8,56.4 22.32,54.92 CON2.B8
  Bottom 0.254: v27.6,59.8 28.3,60.5 86.8,60.5 94.7,68.4 95.95,68.4 SCIO.8
PIN6
  Bottom 0.254: CON2.A6 18.5,52.8 18.5,56.2 23.5,61.2 85.2,61.2 94.9,70.9 SCIO.9
PIN8
  Bottom 0.254: CON2.A7 21.1,52.86 21.1,55.2 23.9,58 27,58 28.7,59.7 88.6,59.7 94.7,65.8 SCIO.7
REFIO
  Bottom 0.406: AD9708.17 73.72,21.29 75.3,19.7 C6.1
RST  (via drill 0.4)
  Top 0.254: v32.2,58 32.2,57.28 30.82,55.9 28.6,55.9 27.4,54.7 CON2.B10
  Bottom 0.254: v32.2,58 32.7,58.5 92.7,58.5 94.9,60.7 95.97,60.7 SCIO.5
SHDN  (via drill 0.4)
  Top 0.254: v30.1,58.4 30.8,59.1 32.7,59.1 33.7,58.1 33.7,52.76 CON2.A12
  Bottom 0.254: v30.1,58.4 30.1,58.7 30.5,59.1 90.7,59.1 94.9,63.3 95.97,63.3 SCIO.6
T1  (via drill 0.4)
  Top 0.305: v69.9,80 71.2,80 71.8,80.6 71.8,84.1 70.58,85.32 CON2.D27
  Bottom 0.305: R2.2 15.05,67 16.2,67 17.2,68 17.2,69.7 26.7,79 68.9,79 v69.9,80
  Bottom 0.813: U$2.1 11.2,67.05 R2.2
T2
  Bottom 0.305: R1.2 18.05,61.05 20,63 20,71 27.3,78.3 70.1,78.3 71.5,79.7 71.5,82.37 CON2.C27
  Bottom 0.813: U$3.1 R1.2
T3
  Bottom 0.305: 15.05,81 R3.2 15.85,81.8 42.5,81.8 43.3,81 66,81 68.04,83.04 CON2.C26
  Bottom 0.813: U$4.1 11.1,80.95 R3.2
T4
  Bottom 0.305: R4.2 22.65,75.95 26.4,79.7 67.8,79.7 69.3,81.2 69.3,84.2 68.9,84.6 66.6,84.6 65.5,85.7 CON2.D25
  Bottom 0.813: U$5.1 15.1,75.95 R4.2
V+
  Top 1.016: CN+.P$2 CN+.P$1
  Bottom 1.016: CN+.P$1 28.1,18.9 28.1,24 D2.A
V-  (via drill 0.6)
  Top 1.016: CN-.P$1 50,18.75 v50,11.3 v50,9.6
  Bottom 1.016: CN-.P$1 50.6,19.4 D1.C | v50,11.3 49.95,11.3 CN-.P$2
V_15  (via drill 0.4)
  Top 0.406: v62.4,69.2 67.7,69.2 69.8,71.3 69.8,73.8 | 69.8,73.8 69.8,74.8 | v75.7,72.4 74.9,73.2 74.9,75.8 v73.8,76.9 72.9,76.9 69.8,73.8
  Bottom 0.406: U$7.2 61.94,68.73 v62.4,69.2 | IC2.6 IC2.7 83.27,72.14 83,72.4 v75.7,72.4 | RGI.1 v73.8,76.9
V_15_UNBUF
  Bottom 0.406: C13.1 88.31,70.36 IC2.5 85.81,68.2 | 85.81,68.2 85.81,67.25 R12.2 | R11.1 80.85,68.65 81.3,68.2 85.81,68.2
V_ANALOG  (via drill 0.3, 0.4)
  Top 0.61: v36.4,70.5 v37.3,71.4 42.1,71.4 v43.9,69.6 v49.5,69.6 51.4,71.5 57.5,71.5 59.2,69.8 v59.2,69.4 v60.2,69.4
  Bottom 0.254: U1.7 42.42,69.03 42.7,69.3 43.6,69.3 v43.9,69.6 v44.6,69.6
  Bottom 0.305: U1.12 39.17,66.4 38.58,65.8 36.2,65.8 35.6,65.2 CD2.1
  Bottom 0.406: CD3.1 48.55,69.6 v49.5,69.6 49.75,69.85 CD4.1
  Bottom 0.61: IC2.8 78.69,70.36 R11.2 75.75,70.55 C23.2 73.85,70.6 C22.1 73.55,70.4 66.5,70.4 | 66.5,70.4 65.85,69.75 C21.1 | U$7.3 60.6,67.27 60.6,69.9 | 60.6,69.9 61.1,70.4 66.5,70.4 | 29.65,66.1 29.85,65.9 | 34.35,68.45 v37.3,71.4 | 60.6,69.9 60.1,69.4 v59.2,69.4
  Bottom 0.813: C12.1 29.65,66.1 29.65,66.4 | 29.65,66.4 U$18.2 | 34.35,68.45 34.35,66.48 | 34.35,66.48 CD2.1 CD1.1 | 34.35,66.48 34.27,66.4 29.65,66.4
VCC+
  Top 0.813: JP1.4 40.27,23.13 44.7,18.7 44.7,9.3 47,7 61,7 62.5,5.5 62.5,3.04 OP_VCC.3
  Bottom 0.61: C5.1 arc90 68.09,4.09 IC1.8
  Bottom 0.813: C9.1 64.65,5.65 | 64.65,5.65 66.3,4 C5.1 | OP_VCC.3 62.54,3.54 64.65,5.65
  Bottom 1.016: JP1.4 JP1.6
VCC-  (via drill 0.6, 0.7)
  Top 0.813: v75,8.8 61.2,8.8 v60,10 v58,10 57,11 57,22 54.67,24.33 JP1.2
  Bottom 0.406: IC1.4 71.9,9.8 74.8,9.8 75,10 | C4.1 75,10.6 75,10 | 75,10 v75,8.8
  Bottom 0.813: v58,10 v60,10 | C10.2 56,10 v58,10 | OP_VCC.1 57.46,9.46 v58,10 | JP1.8 35.19,23.41 36.1,22.5 40.98,22.5 JP1.2
VEE  (via drill 0.6, 0.8)
  Top 0.813: 7.5,39.9 7.4,40
  Top 1.016: v15,17 7.5,24.5 7.5,39.9 | 7.4,40 v5,40
  Bottom 0.813: U$1.1 15,13.41 15,14 C1.1
  Bottom 1.016: v15,17 15,14 | v6.4,40 v5,40 5,51.08 CON2.A1 CON2.B1
VPP
  Bottom 0.61: CON2.B15 42.02,56 86,56 89,53 95.89,53 SCIO.2

### Text on the board
tNames: 3V3 | GND | 0 | 1 | 2 | 3 | 4 | 5 | 6 | 7 | R9 | CLK2 | CLK28 | GIAnT revB 6/21 | IO1 | <-USB | T3 | 3V3 | ADC | 3V3 | T4 | GND | P6 | GND | GND | P4 | T1 | P8 | 5V | SHDW | 5V | RST | CLK | T2 | I/O | 3V3 | GND | <- USB | 3V3 | GND | (C) '21 / David Oswald | 0 | 1 | wrong => boom | 2 | ext | 3 | +5V | V+ | int | V- | 4 | max -15V | 5 | 6 | 7 | IO2 | max +15V | GND | 50R | GND | 0R | - | + | OUT_INV
bNames: GIAnT revB 6/21 | WARNING: / HIGH FAULTAGE